# EAGLE schematic qo-100-lnb-controller (EAGLE 9.6.1)
CREVISION: 2; DESIGNER: Joao Silva

## Sheet 1 of 5: MCU
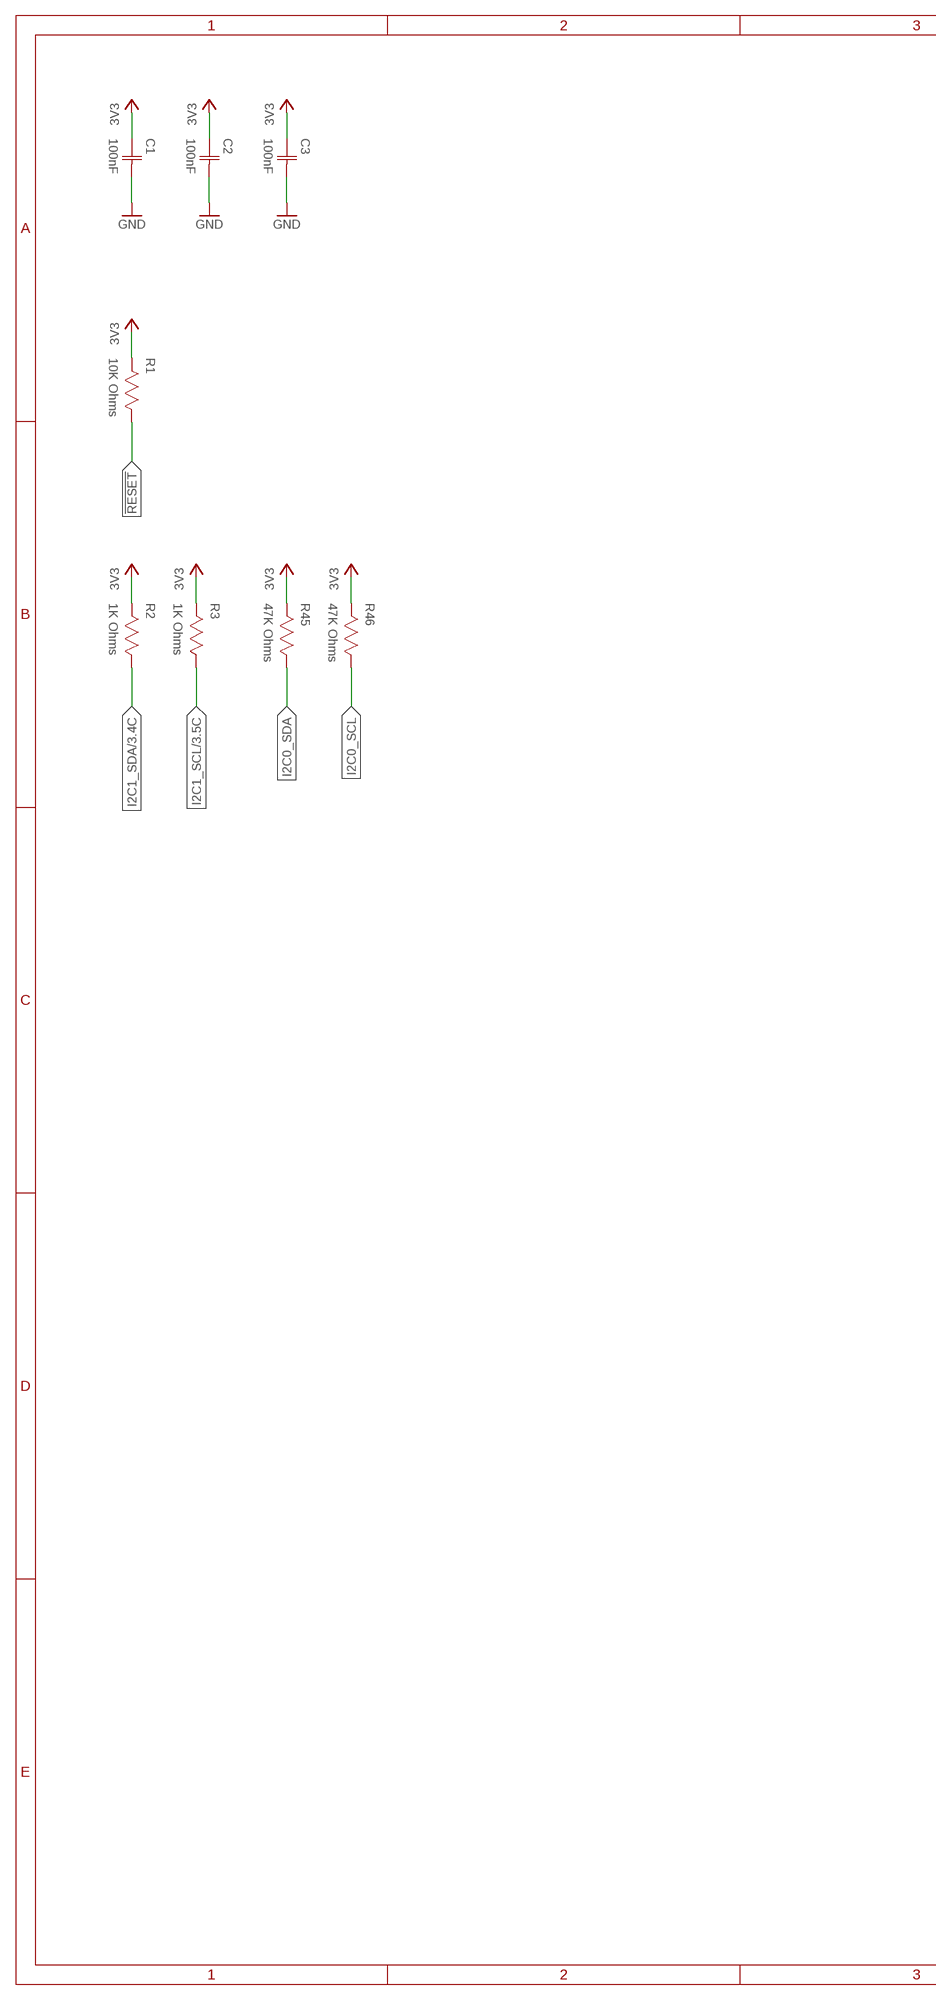
[diagram p0: schematic, sheet 1, part 1 of 2]
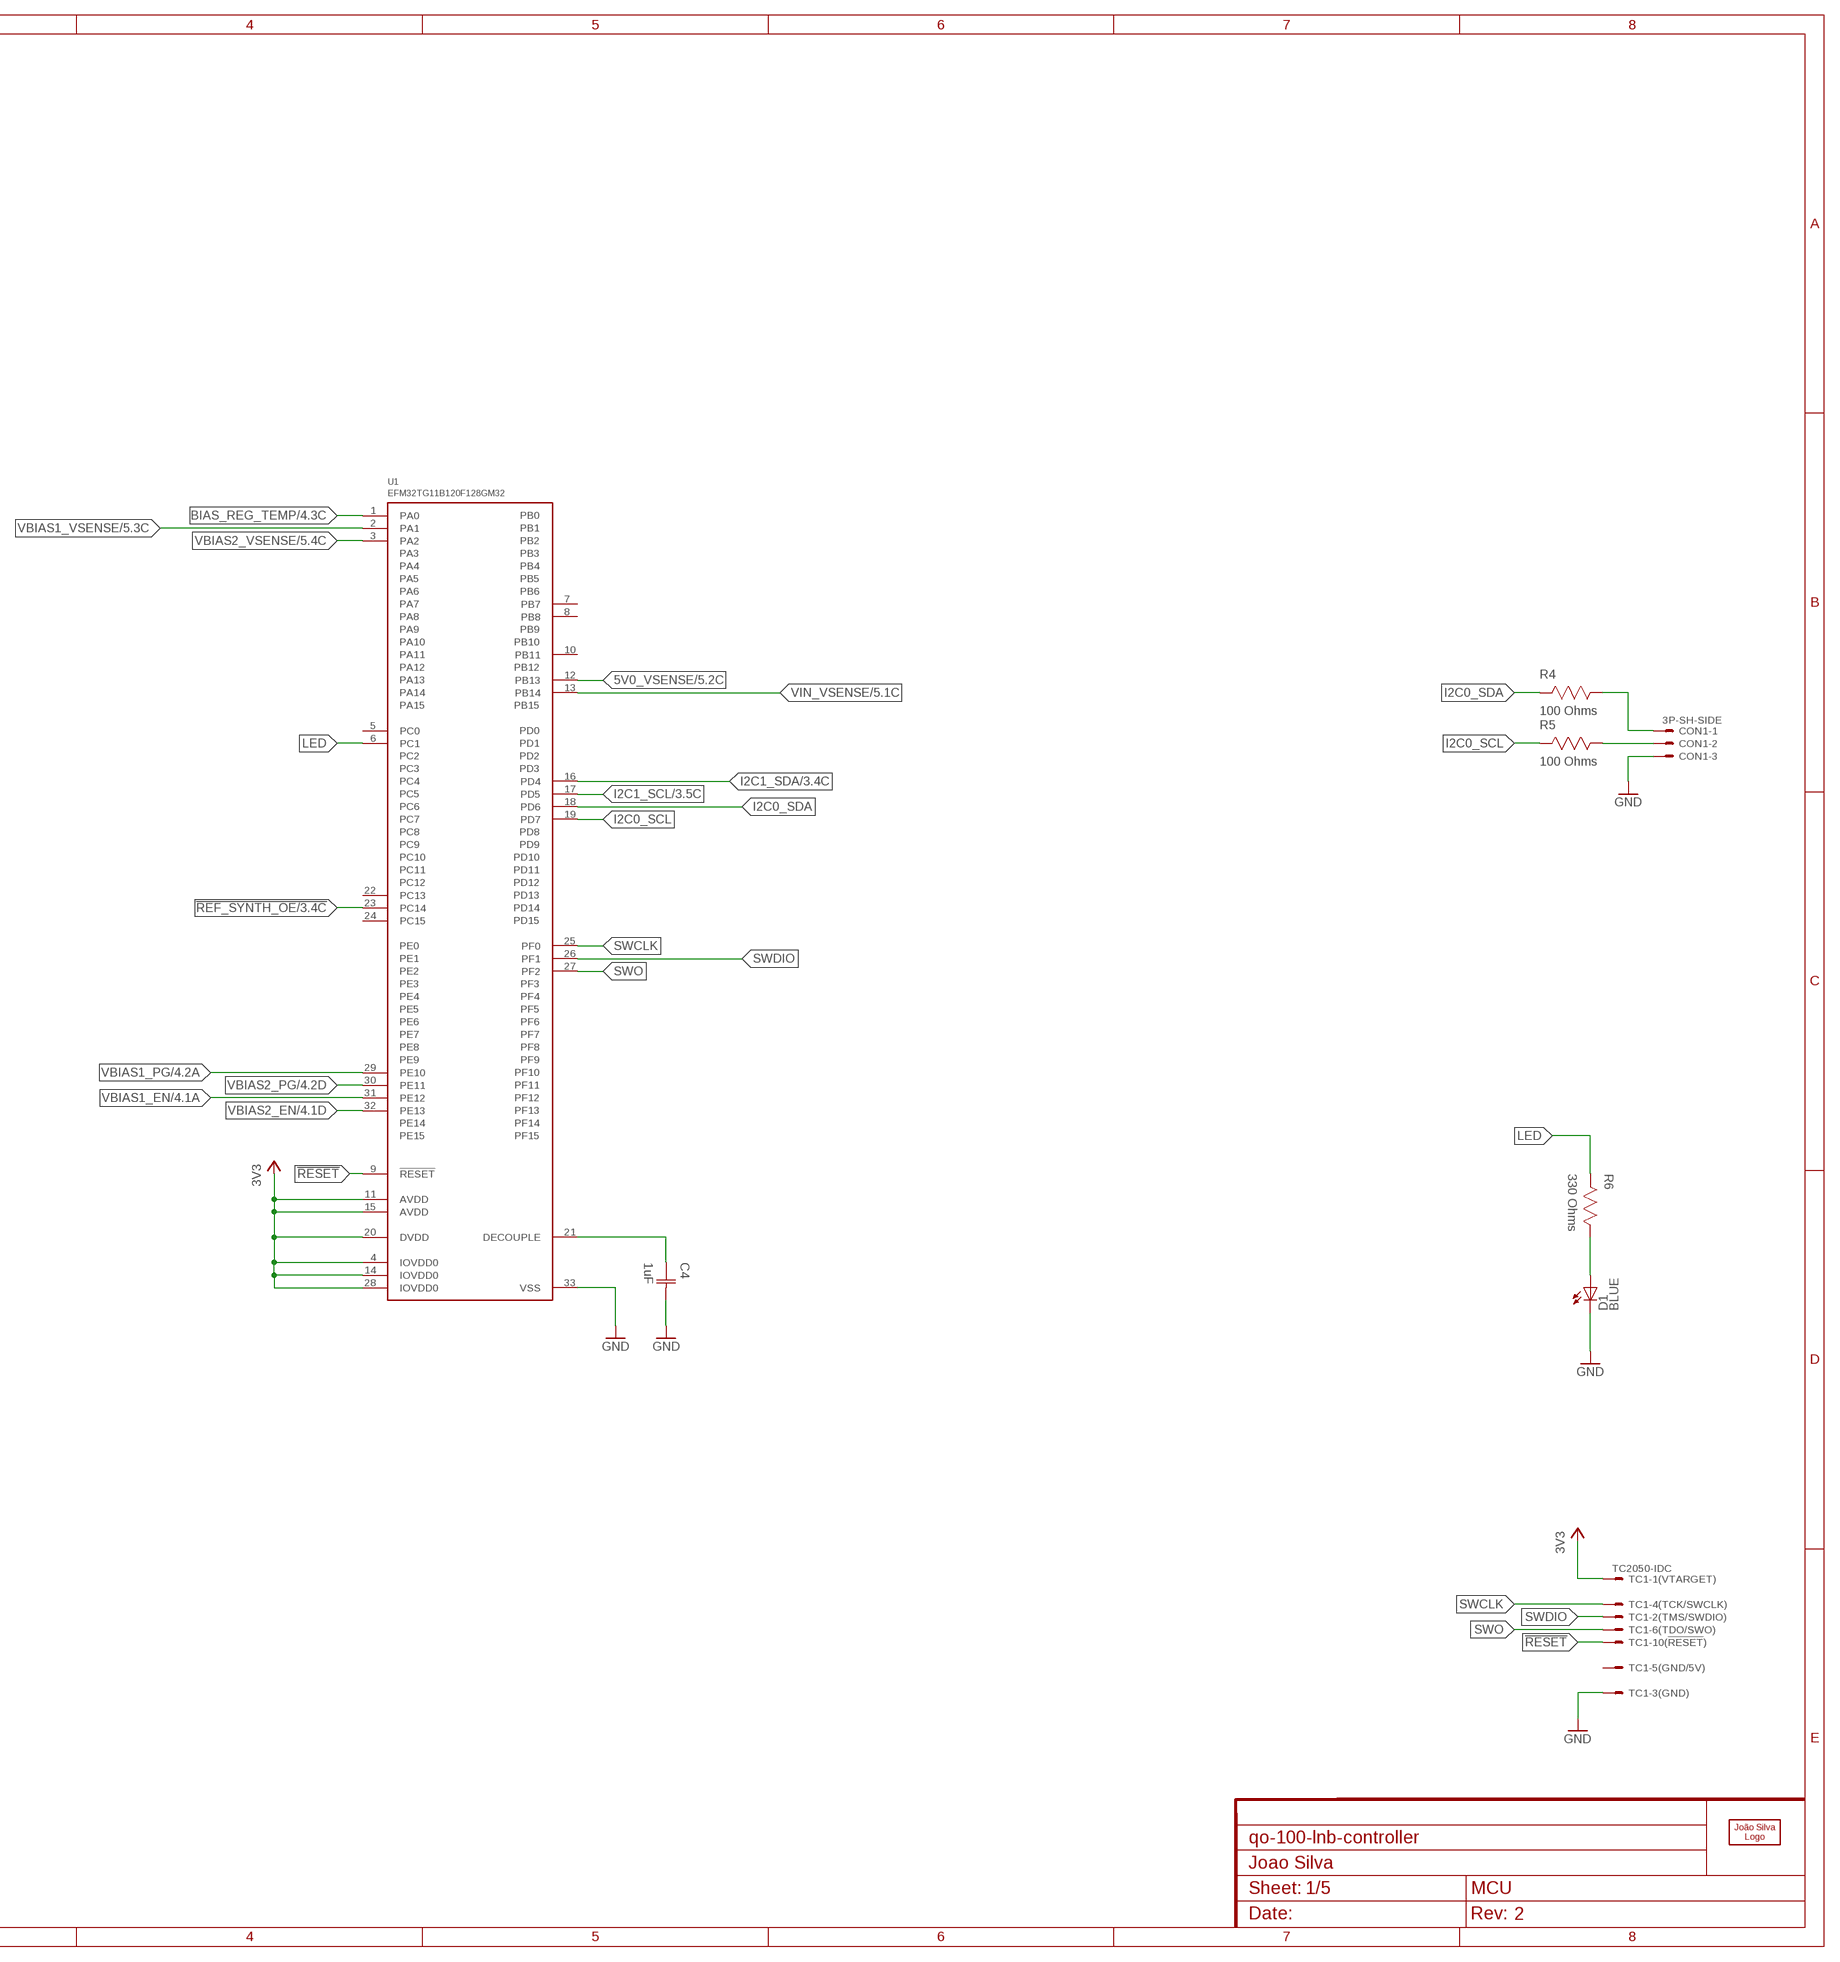
[diagram p1: schematic, sheet 1, part 2 of 2]

### Parts
C1  100nF  CAPACITOR-0603  [CAP0603]
C2  100nF  CAPACITOR-0603  [CAP0603]
C3  100nF  CAPACITOR-0603  [CAP0603]
C4  1uF  CAPACITOR-0603  [CAP0603]
CON1  3P-SH-SIDE  [SH-03-SIDE]
D1  LED0603  [0603]
LOGO1  JS-10MM  [JS_10MM]
R1  10K Ohms  RESISTOR-0603  [RES0603]
R2  1K Ohms  RESISTOR-0603  [RES0603]
R3  1K Ohms  RESISTOR-0603  [RES0603]
R4  100 Ohms  RESISTOR-0603  [RES0603]
R5  100 Ohms  RESISTOR-0603  [RES0603]
R6  330 Ohms  RESISTOR-0603  [RES0603]
R45  47K Ohms  RESISTOR-0603  [RES0603]
R46  47K Ohms  RESISTOR-0603  [RES0603]
TC1  TC2050-IDC  [TC2050-IDC]
U1  EFM32TG11B120F128GM32  [QFN32_0.5P_TG]

### Nets
3V3: C1.1(C1) C2.1(C1) C3.1(C1) R1.2 R2.2 R3.2 R45.2 R46.2 TC1.1 U1.4(IOVDD0) U1.11(AVDD) U1.14(IOVDD0) U1.15(AVDD) U1.20(DVDD) U1.28(IOVDD0) ; also sheet 3,4,5
5V0_VSENSE: U1.12(PB13) ; also sheet 5
!REF_SYNTH_OE: U1.23(PC14) ; also sheet 3
!RESET: R1.1 TC1.10 U1.9(!RESET)
BIAS_REG_TEMP: U1.1(PA0) ; also sheet 4
GND: C1.2(C2) C2.2(C2) C3.2(C2) C4.2(C2) CON1.3 D1.C TC1.3 U1.33(VSS) ; also sheet 2,3,4,5
I2C0_SCL: R5.2 R46.1 U1.19(PD7)
I2C0_SDA: R4.2 R45.1 U1.18(PD6)
I2C1_SCL: R3.1 U1.17(PD5) ; also sheet 3,4
I2C1_SDA: R2.1 U1.16(PD4) ; also sheet 3,4
LED: R6.2 U1.6(PC1)
N$4: CON1.2 R5.1
N$6: C4.1(C1) U1.21(DECOUPLE)
N$25: D1.A R6.1
N$38: CON1.1 R4.1
SWCLK: TC1.4 U1.25(PF0)
SWDIO: TC1.2 U1.26(PF1)
SWO: TC1.6 U1.27(PF2)
VBIAS1_EN: U1.31(PE12) ; also sheet 4
VBIAS1_PG: U1.29(PE10) ; also sheet 4
VBIAS1_VSENSE: U1.2(PA1) ; also sheet 5
VBIAS2_EN: U1.32(PE13) ; also sheet 4
VBIAS2_PG: U1.30(PE11) ; also sheet 4
VBIAS2_VSENSE: U1.3(PA2) ; also sheet 5
VIN_VSENSE: U1.13(PB14) ; also sheet 5
Unconnected: TC1.5 TC1.7 TC1.8 TC1.9 U1.5(PC0) U1.7(PB7) U1.8(PB8) U1.10(PB11) U1.22(PC13) U1.24(PC15)

## Sheet 2 of 5: RF Path
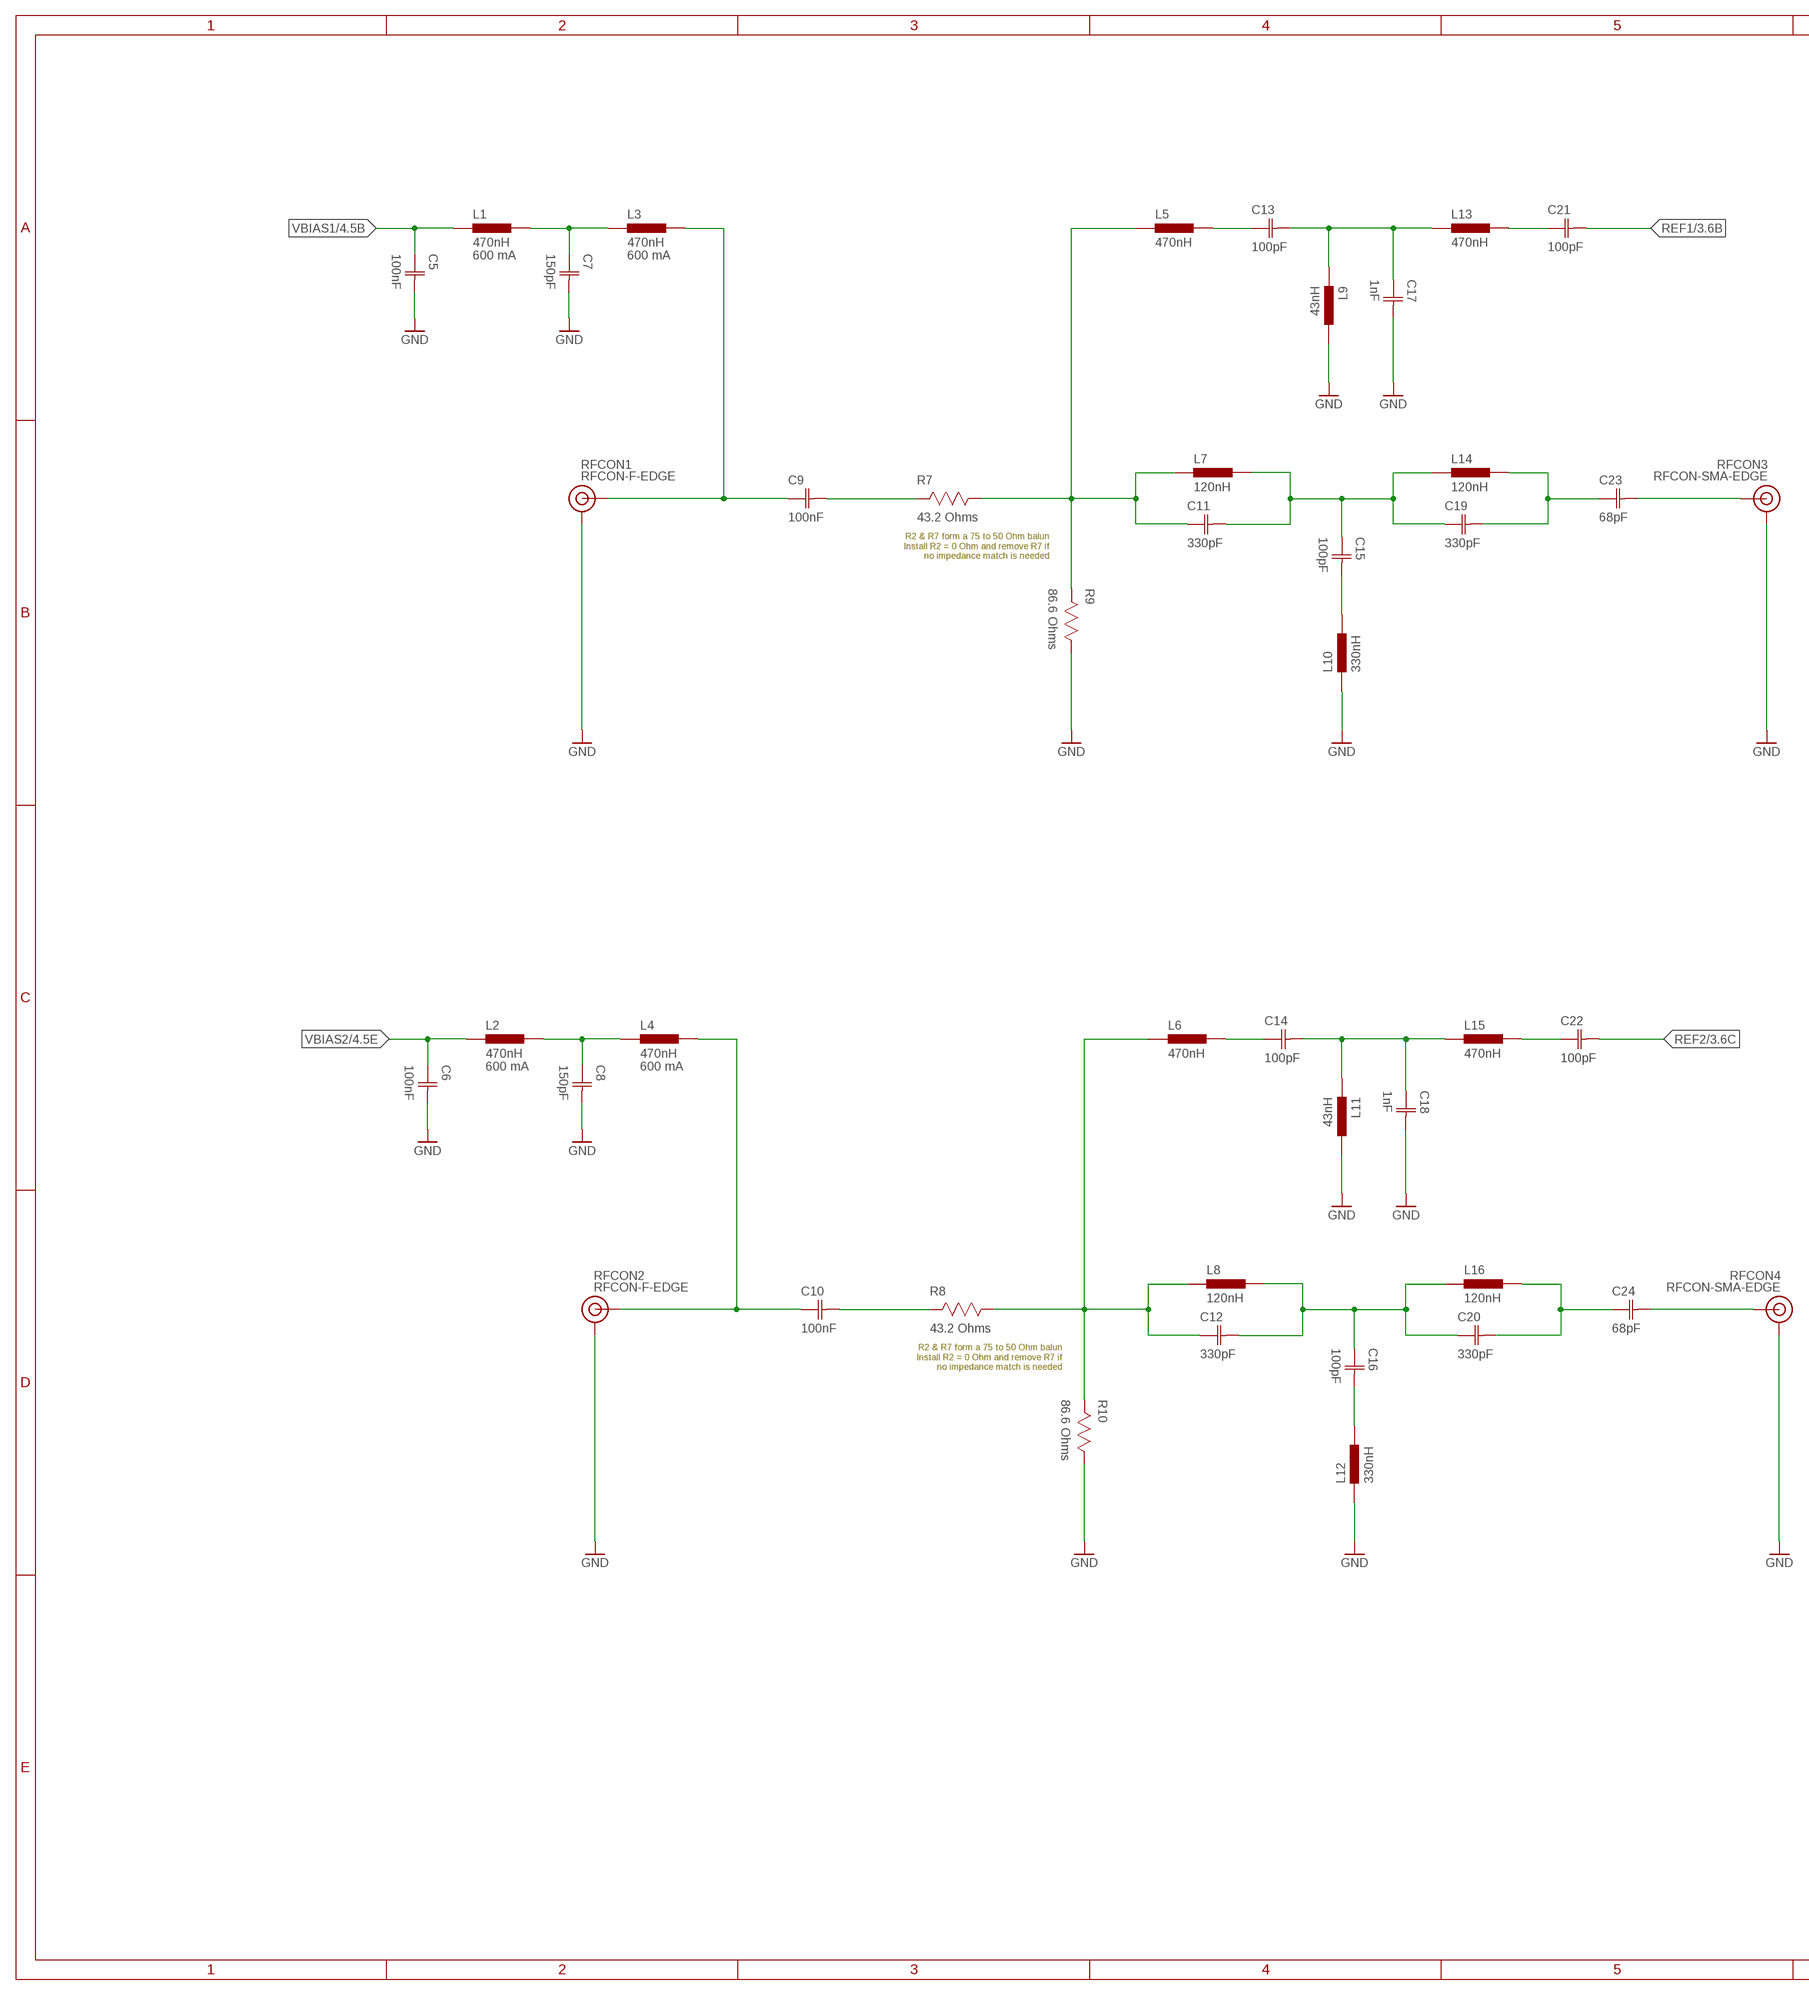
[diagram p2: schematic, sheet 2, part 1 of 2]
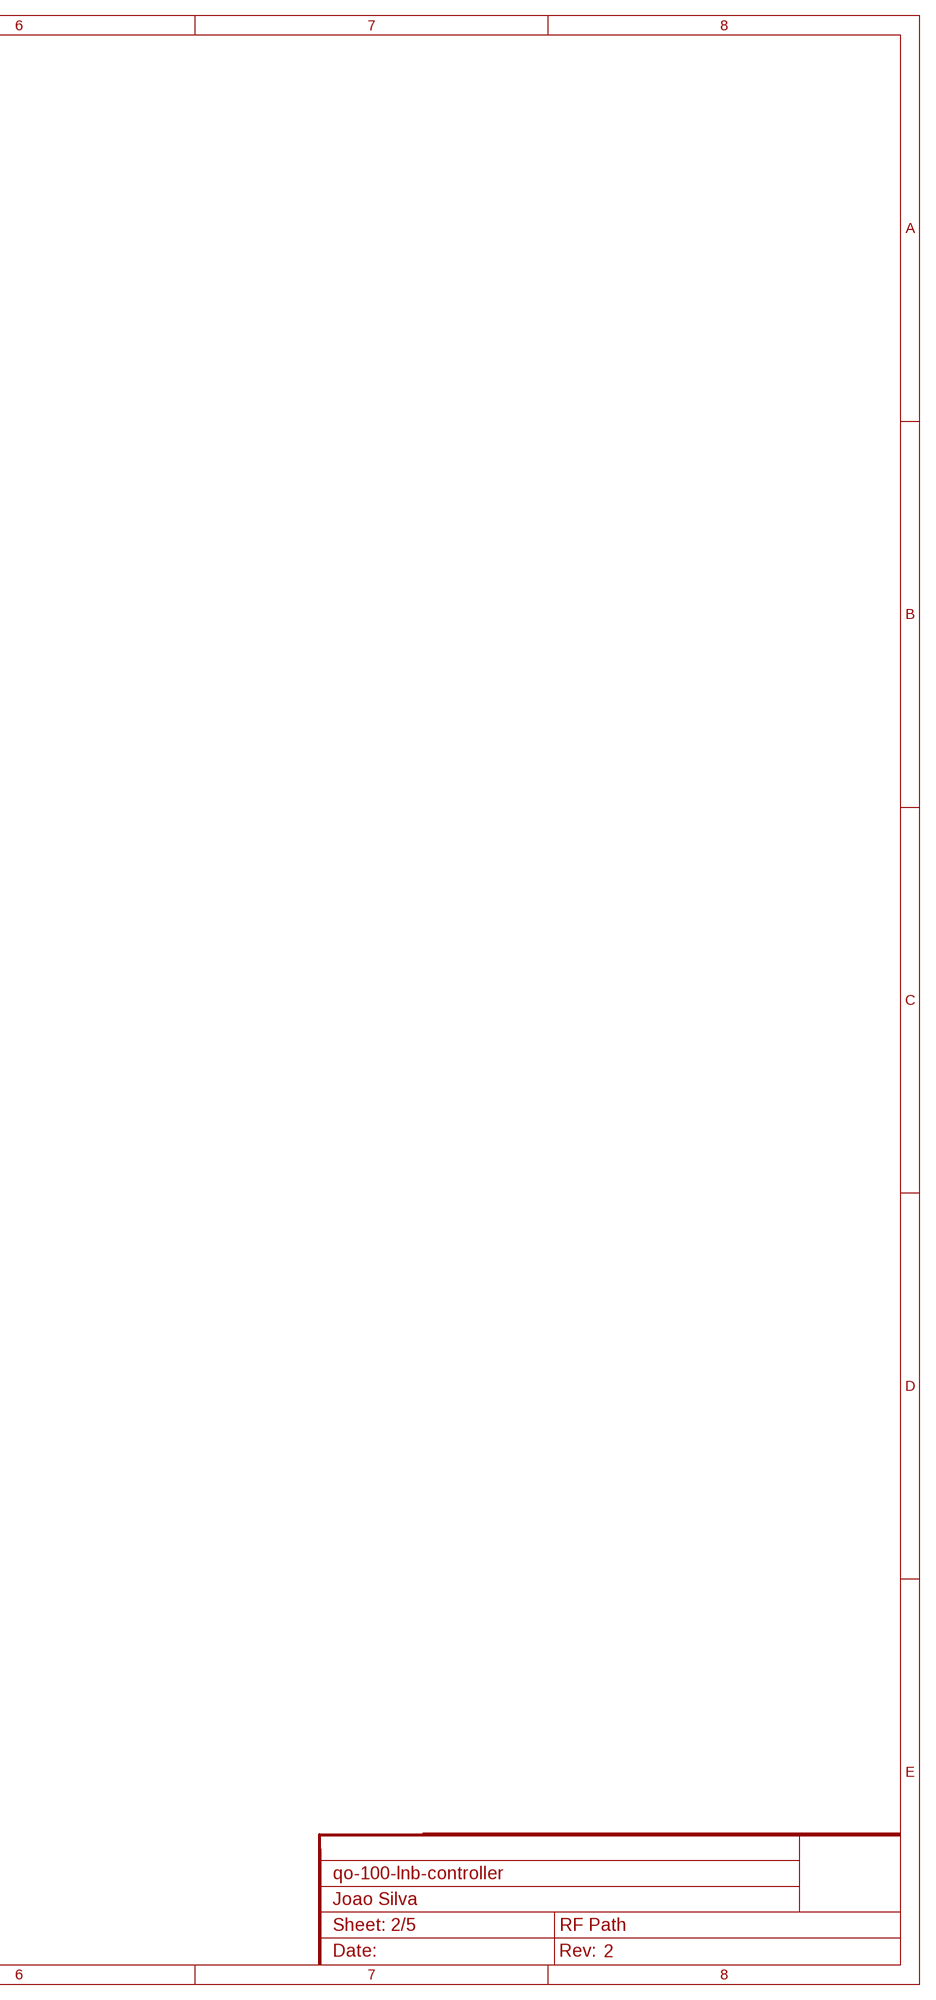
[diagram p3: schematic, sheet 2, part 2 of 2]

### Parts
C5  100nF  CAPACITOR-0603  [CAP0603]
C6  100nF  CAPACITOR-0603  [CAP0603]
C7  150pF  CAPACITOR-0603  [CAP0603]
C8  150pF  CAPACITOR-0603  [CAP0603]
C9  100nF  CAPACITOR-0603  [CAP0603]
C10  100nF  CAPACITOR-0603  [CAP0603]
C11  330pF  CAPACITOR-0603  [CAP0603]
C12  330pF  CAPACITOR-0603  [CAP0603]
C13  100pF  CAPACITOR-0603  [CAP0603]
C14  100pF  CAPACITOR-0603  [CAP0603]
C15  100pF  CAPACITOR-0603  [CAP0603]
C16  100pF  CAPACITOR-0603  [CAP0603]
C17  1nF  CAPACITOR-0603  [CAP0603]
C18  1nF  CAPACITOR-0603  [CAP0603]
C19  330pF  CAPACITOR-0603  [CAP0603]
C20  330pF  CAPACITOR-0603  [CAP0603]
C21  100pF  CAPACITOR-0603  [CAP0603]
C22  100pF  CAPACITOR-0603  [CAP0603]
C23  68pF  CAPACITOR-0603  [CAP0603]
C24  68pF  CAPACITOR-0603  [CAP0603]
L1  470nH  INDUCTOR-0603  [IND0603]
L2  470nH  INDUCTOR-0603  [IND0603]
L3  470nH  INDUCTOR-0603  [IND0603]
L4  470nH  INDUCTOR-0603  [IND0603]
L5  470nH  INDUCTOR-0603  [IND0603]
L6  470nH  INDUCTOR-0603  [IND0603]
L7  120nH  INDUCTOR-0603  [IND0603]
L8  120nH  INDUCTOR-0603  [IND0603]
L9  43nH  INDUCTOR-0603  [IND0603]
L10  330nH  INDUCTOR-0603  [IND0603]
L11  43nH  INDUCTOR-0603  [IND0603]
L12  330nH  INDUCTOR-0603  [IND0603]
L13  470nH  INDUCTOR-0603  [IND0603]
L14  120nH  INDUCTOR-0603  [IND0603]
L15  470nH  INDUCTOR-0603  [IND0603]
L16  120nH  INDUCTOR-0603  [IND0603]
R7  43.2 Ohms  RESISTOR-0603  [RES0603]
R8  43.2 Ohms  RESISTOR-0603  [RES0603]
R9  86.6 Ohms  RESISTOR-0603  [RES0603]
R10  86.6 Ohms  RESISTOR-0603  [RES0603]
RFCON1  RFCON-F-EDGE  [F-EDGE]
RFCON2  RFCON-F-EDGE  [F-EDGE]
RFCON3  RFCON-SMA-EDGE  [SMA-EDGE]
RFCON4  RFCON-SMA-EDGE  [SMA-EDGE]

### Nets
GND: C5.2(C2) C6.2(C2) C7.2(C2) C8.2(C2) C17.2(C2) C18.2(C2) L9.2 L10.1 L11.2 L12.1 R9.1 R10.1 RFCON1.GND@0(GND) RFCON1.GND@1(GND) RFCON1.GND@2(GND) RFCON1.GND@3(GND) RFCON1.GND@4(GND) RFCON1.GND@5(GND) RFCON2.GND@0(GND) RFCON2.GND@1(GND) RFCON2.GND@2(GND) RFCON2.GND@3(GND) RFCON2.GND@4(GND) RFCON2.GND@5(GND) RFCON3.GND@0(GND) RFCON3.GND@1(GND) RFCON3.GND@2(GND) RFCON3.GND@3(GND) RFCON4.GND@0(GND) RFCON4.GND@1(GND) RFCON4.GND@2(GND) RFCON4.GND@3(GND) ; also sheet 1,3,4,5
N$9 [75 Ohm]: C9.1(C1) L3.2 RFCON1.SIGNAL
N$10 [75 Ohm]: C9.2(C2) R7.2
N$12: C21.1(C1) L13.2
N$13: C7.1(C1) L1.2 L3.1
N$14: C13.1(C1) L5.2
N$15: C13.2(C2) C17.1(C1) L9.1 L13.1
N$16: C19.2(C2) C23.1(C1) L14.2
N$17: C11.1(C1) L5.1 L7.1 R7.1 R9.2
N$18: C11.2(C2) C15.1(C1) C19.1(C1) L7.2 L14.1
N$20: C23.2(C2) RFCON3.SIG(SIGNAL)
N$22: C15.2(C2) L10.2
N$24 [75 Ohm]: C10.1(C1) L4.2 RFCON2.SIGNAL
N$26 [75 Ohm]: C10.2(C2) R8.2
N$27: C8.1(C1) L2.2 L4.1
N$28: C22.1(C1) L15.2
N$29: C14.1(C1) L6.2
N$30: C14.2(C2) C18.1(C1) L11.1 L15.1
N$31: C12.1(C1) L6.1 L8.1 R8.1 R10.2
N$32: C12.2(C2) C16.1(C1) C20.1(C1) L8.2 L16.1
N$33: C24.2(C2) RFCON4.SIG(SIGNAL)
N$34: C16.2(C2) L12.2
N$35: C20.2(C2) C24.1(C1) L16.2
REF1: C21.2(C2) ; also sheet 3
REF2: C22.2(C2) ; also sheet 3
VBIAS1: C5.1(C1) L1.1 ; also sheet 4,5
VBIAS2: C6.1(C1) L2.1 ; also sheet 4,5

### Notes on the sheet
- R2 & R7 form a 75 to 50 Ohm balun
  Install R2 = 0 Ohm and remove R7 if
  no impedance match is needed
- R2 & R7 form a 75 to 50 Ohm balun
  Install R2 = 0 Ohm and remove R7 if
  no impedance match is needed

## Sheet 3 of 5: Reference Synthesizer
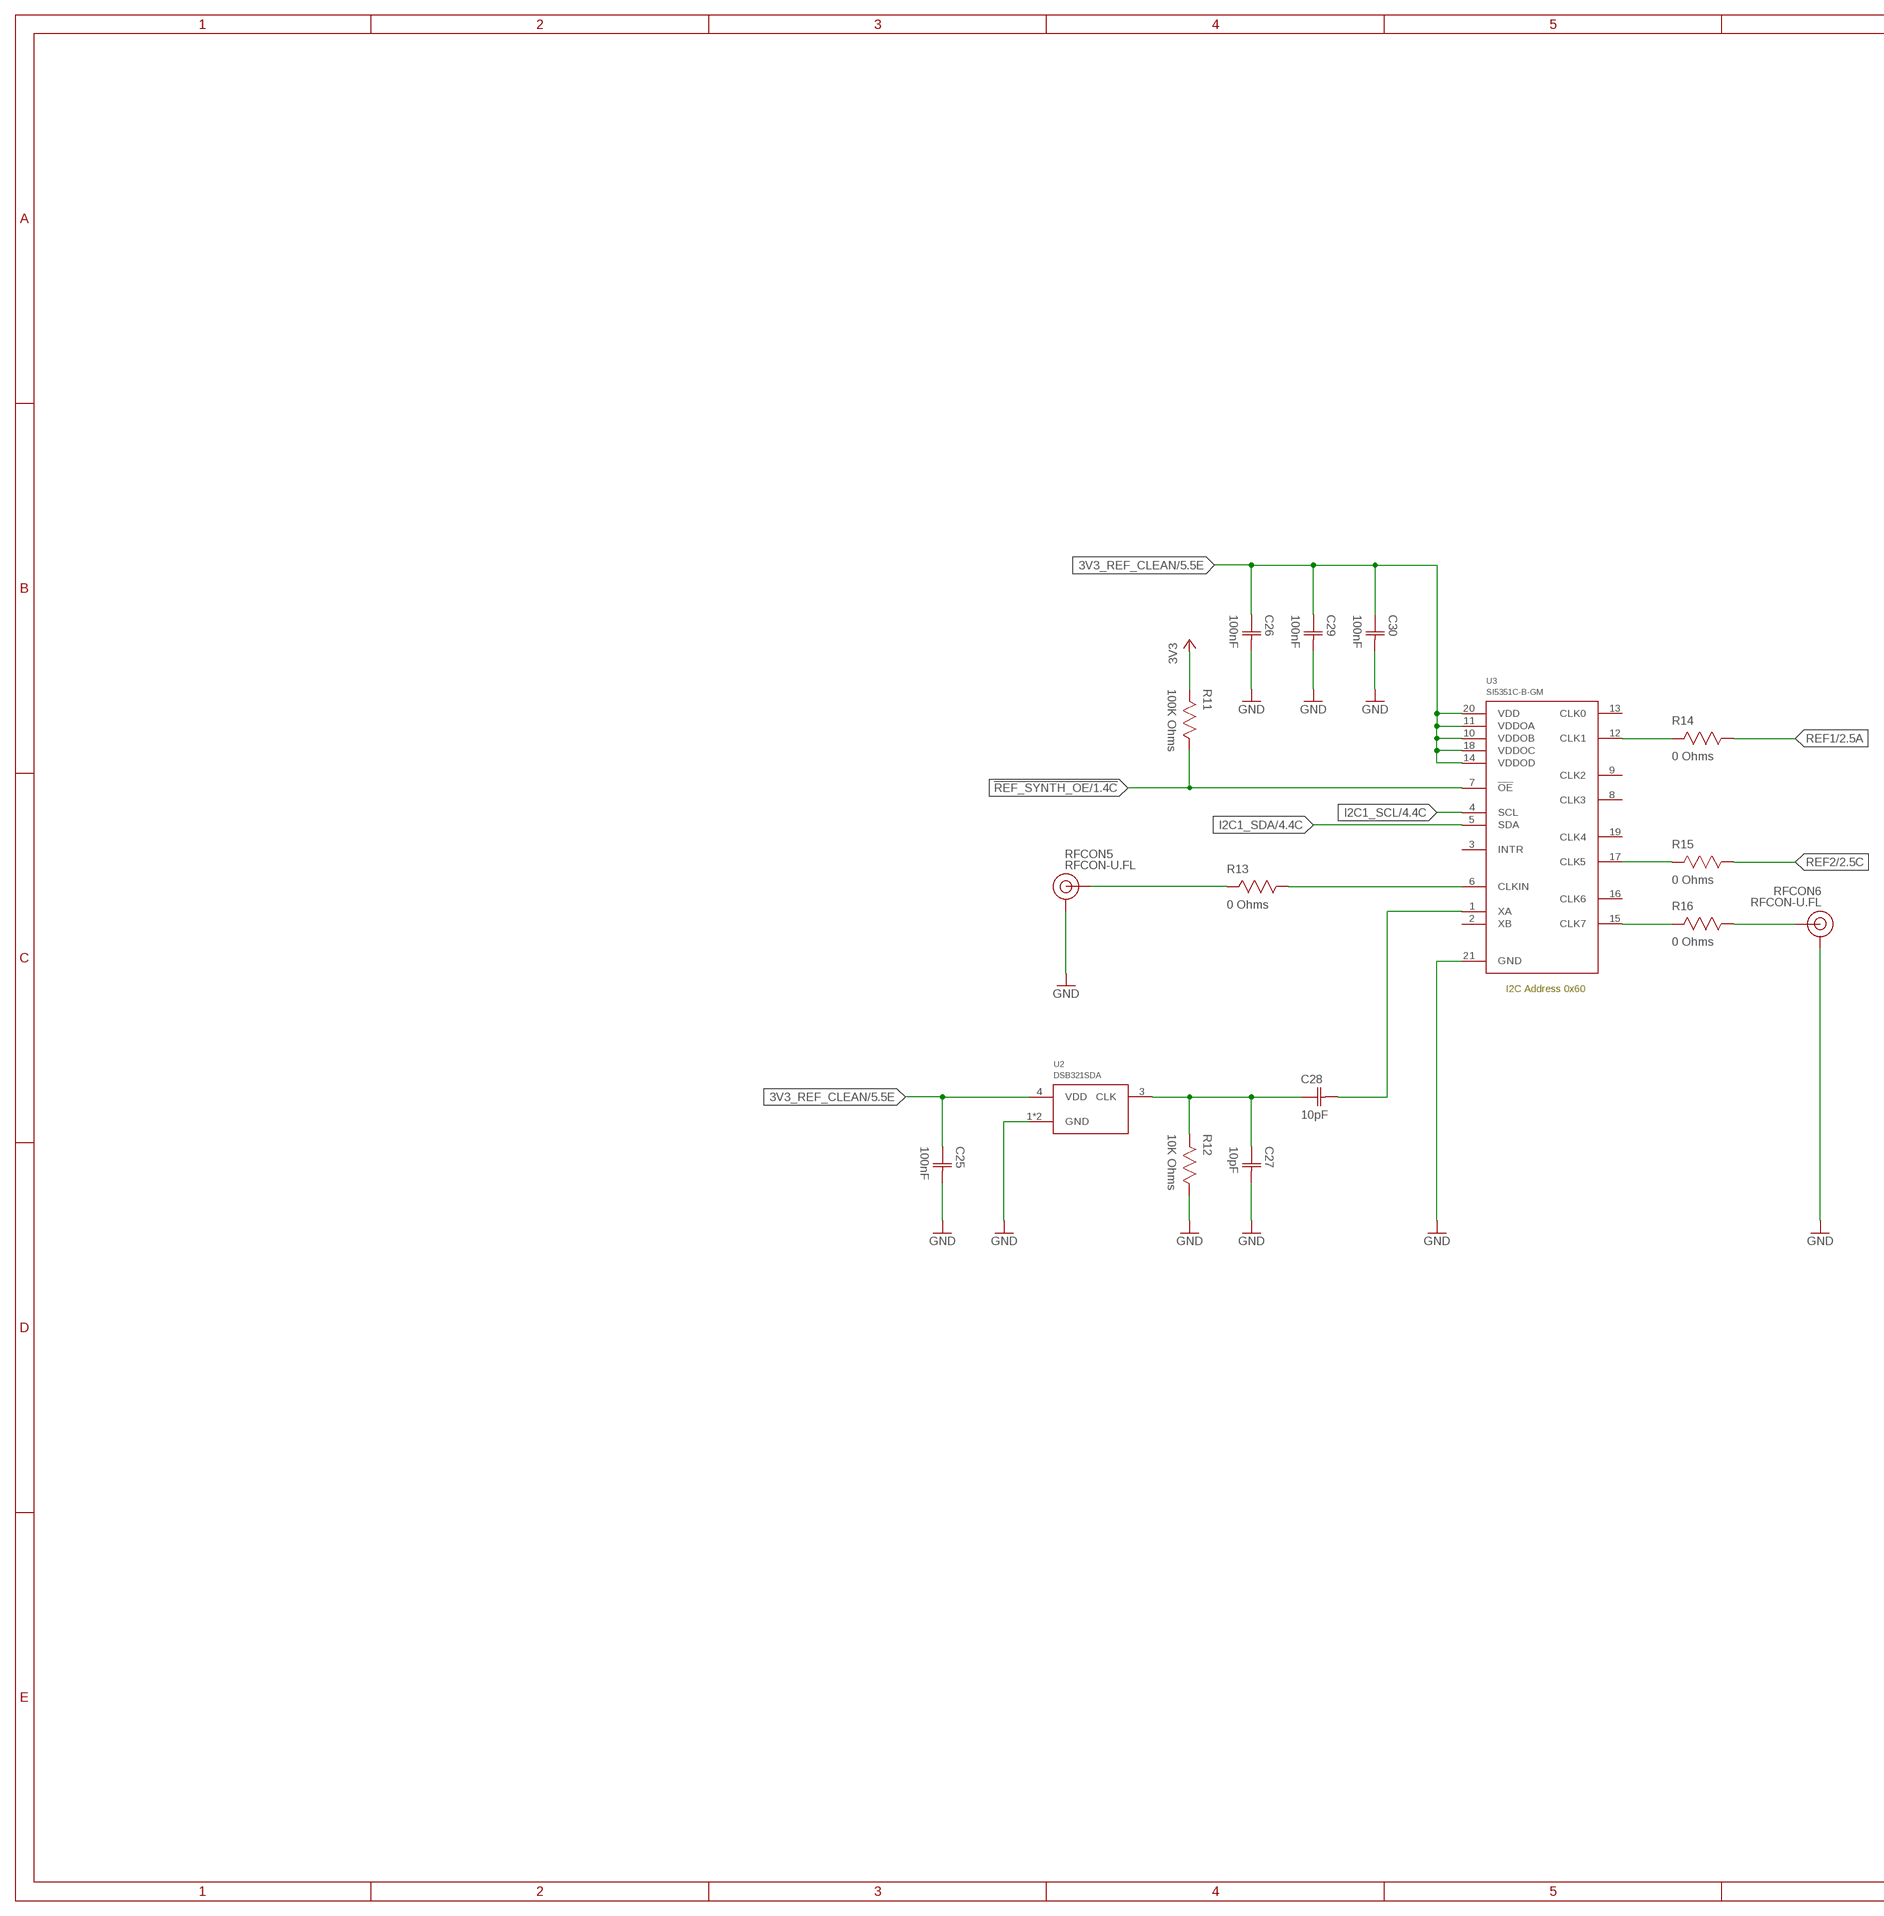
[diagram p4: schematic, sheet 3, part 1 of 2]
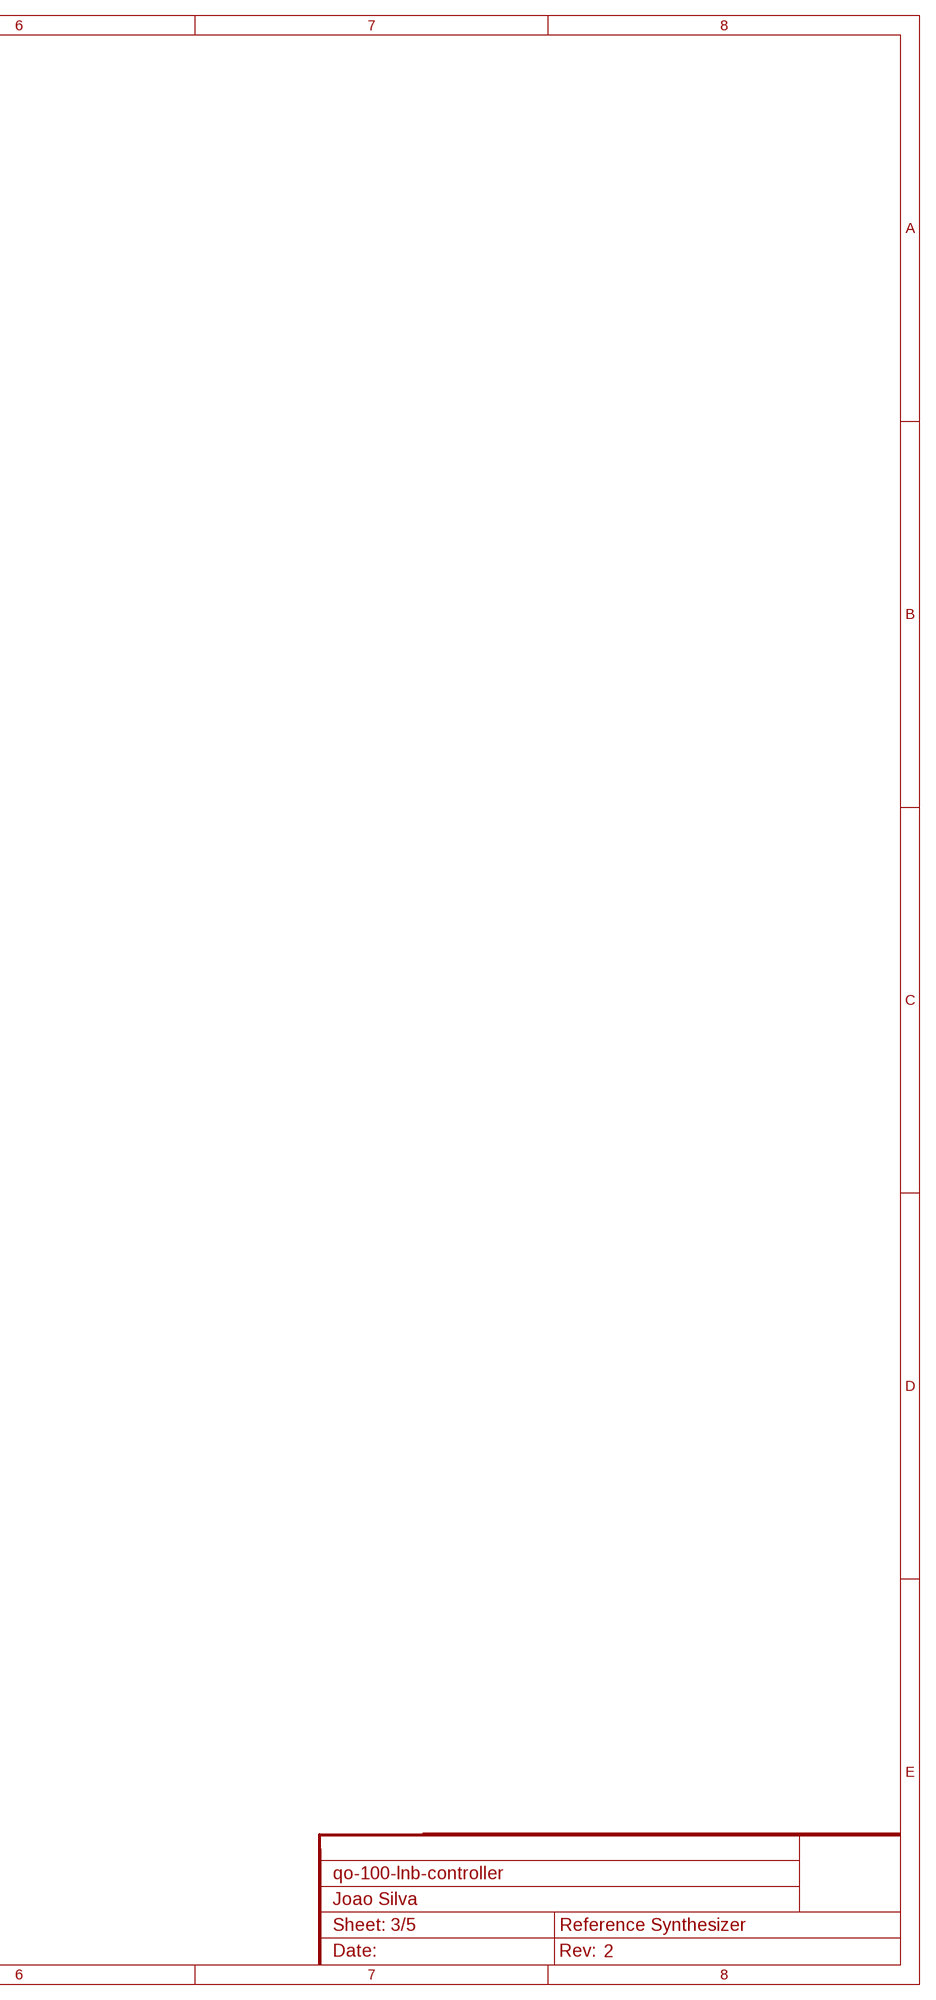
[diagram p5: schematic, sheet 3, part 2 of 2]

### Parts
C25  100nF  CAPACITOR-0603  [CAP0603]
C26  100nF  CAPACITOR-0603  [CAP0603]
C27  10pF  CAPACITOR-0603  [CAP0603]
C28  10pF  CAPACITOR-0603  [CAP0603]
C29  100nF  CAPACITOR-0603  [CAP0603]
C30  100nF  CAPACITOR-0603  [CAP0603]
R11  100K Ohms  RESISTOR-0603  [RES0603]
R12  10K Ohms  RESISTOR-0603  [RES0603]
R13  0 Ohms  RESISTOR-0603  [RES0603]
R14  0 Ohms  RESISTOR-0603  [RES0603]
R15  0 Ohms  RESISTOR-0603  [RES0603]
R16  0 Ohms  RESISTOR-0603  [RES0603]
RFCON5  RFCON-U.FL  [U.FL]
RFCON6  RFCON-U.FL  [U.FL]
U2  DSB321SDA  [TCXO-3225]
U3  SI5351C-B-GM  [QFN20]

### Nets
3V3: R11.2 ; also sheet 1,4,5
3V3_REF_CLEAN: C25.1(C1) C26.1(C1) C29.1(C1) C30.1(C1) U2.4(VDD) U3.10(VDDOB) U3.11(VDDOA) U3.14(VDDOD) U3.18(VDDOC) U3.20(VDD) ; also sheet 5
!REF_SYNTH_OE: R11.1 U3.7(!OE) ; also sheet 1
EXT_REF_IN: R13.2 RFCON5.P$3(SIGNAL)
EXT_REF_OUT: R16.1 RFCON6.P$3(SIGNAL)
GND: C25.2(C2) C26.2(C2) C27.2(C2) C29.2(C2) C30.2(C2) R12.1 RFCON5.P$1(GND) RFCON5.P$2(GND) RFCON6.P$1(GND) RFCON6.P$2(GND) U2.1(GND) U2.2(GND) U3.21(GND) ; also sheet 1,2,4,5
I2C1_SCL: U3.4(SCL) ; also sheet 1,4
I2C1_SDA: U3.5(SDA) ; also sheet 1,4
N$1: R16.2 U3.15(CLK7)
N$2: R15.2 U3.17(CLK5)
N$5: R14.2 U3.12(CLK1)
N$7: C27.1(C1) C28.1(C1) R12.2 U2.3(CLK)
N$36: C28.2(C2) U3.1(XA)
N$37: R13.1 U3.6(CLKIN)
REF1: R14.1 ; also sheet 2
REF2: R15.1 ; also sheet 2
Unconnected: U3.2(XB) U3.3(INTR) U3.8(CLK3) U3.9(CLK2) U3.13(CLK0) U3.16(CLK6) U3.19(CLK4)

### Notes on the sheet
- I2C Address 0x60

## Sheet 4 of 5: Power 1 - LNB Bias
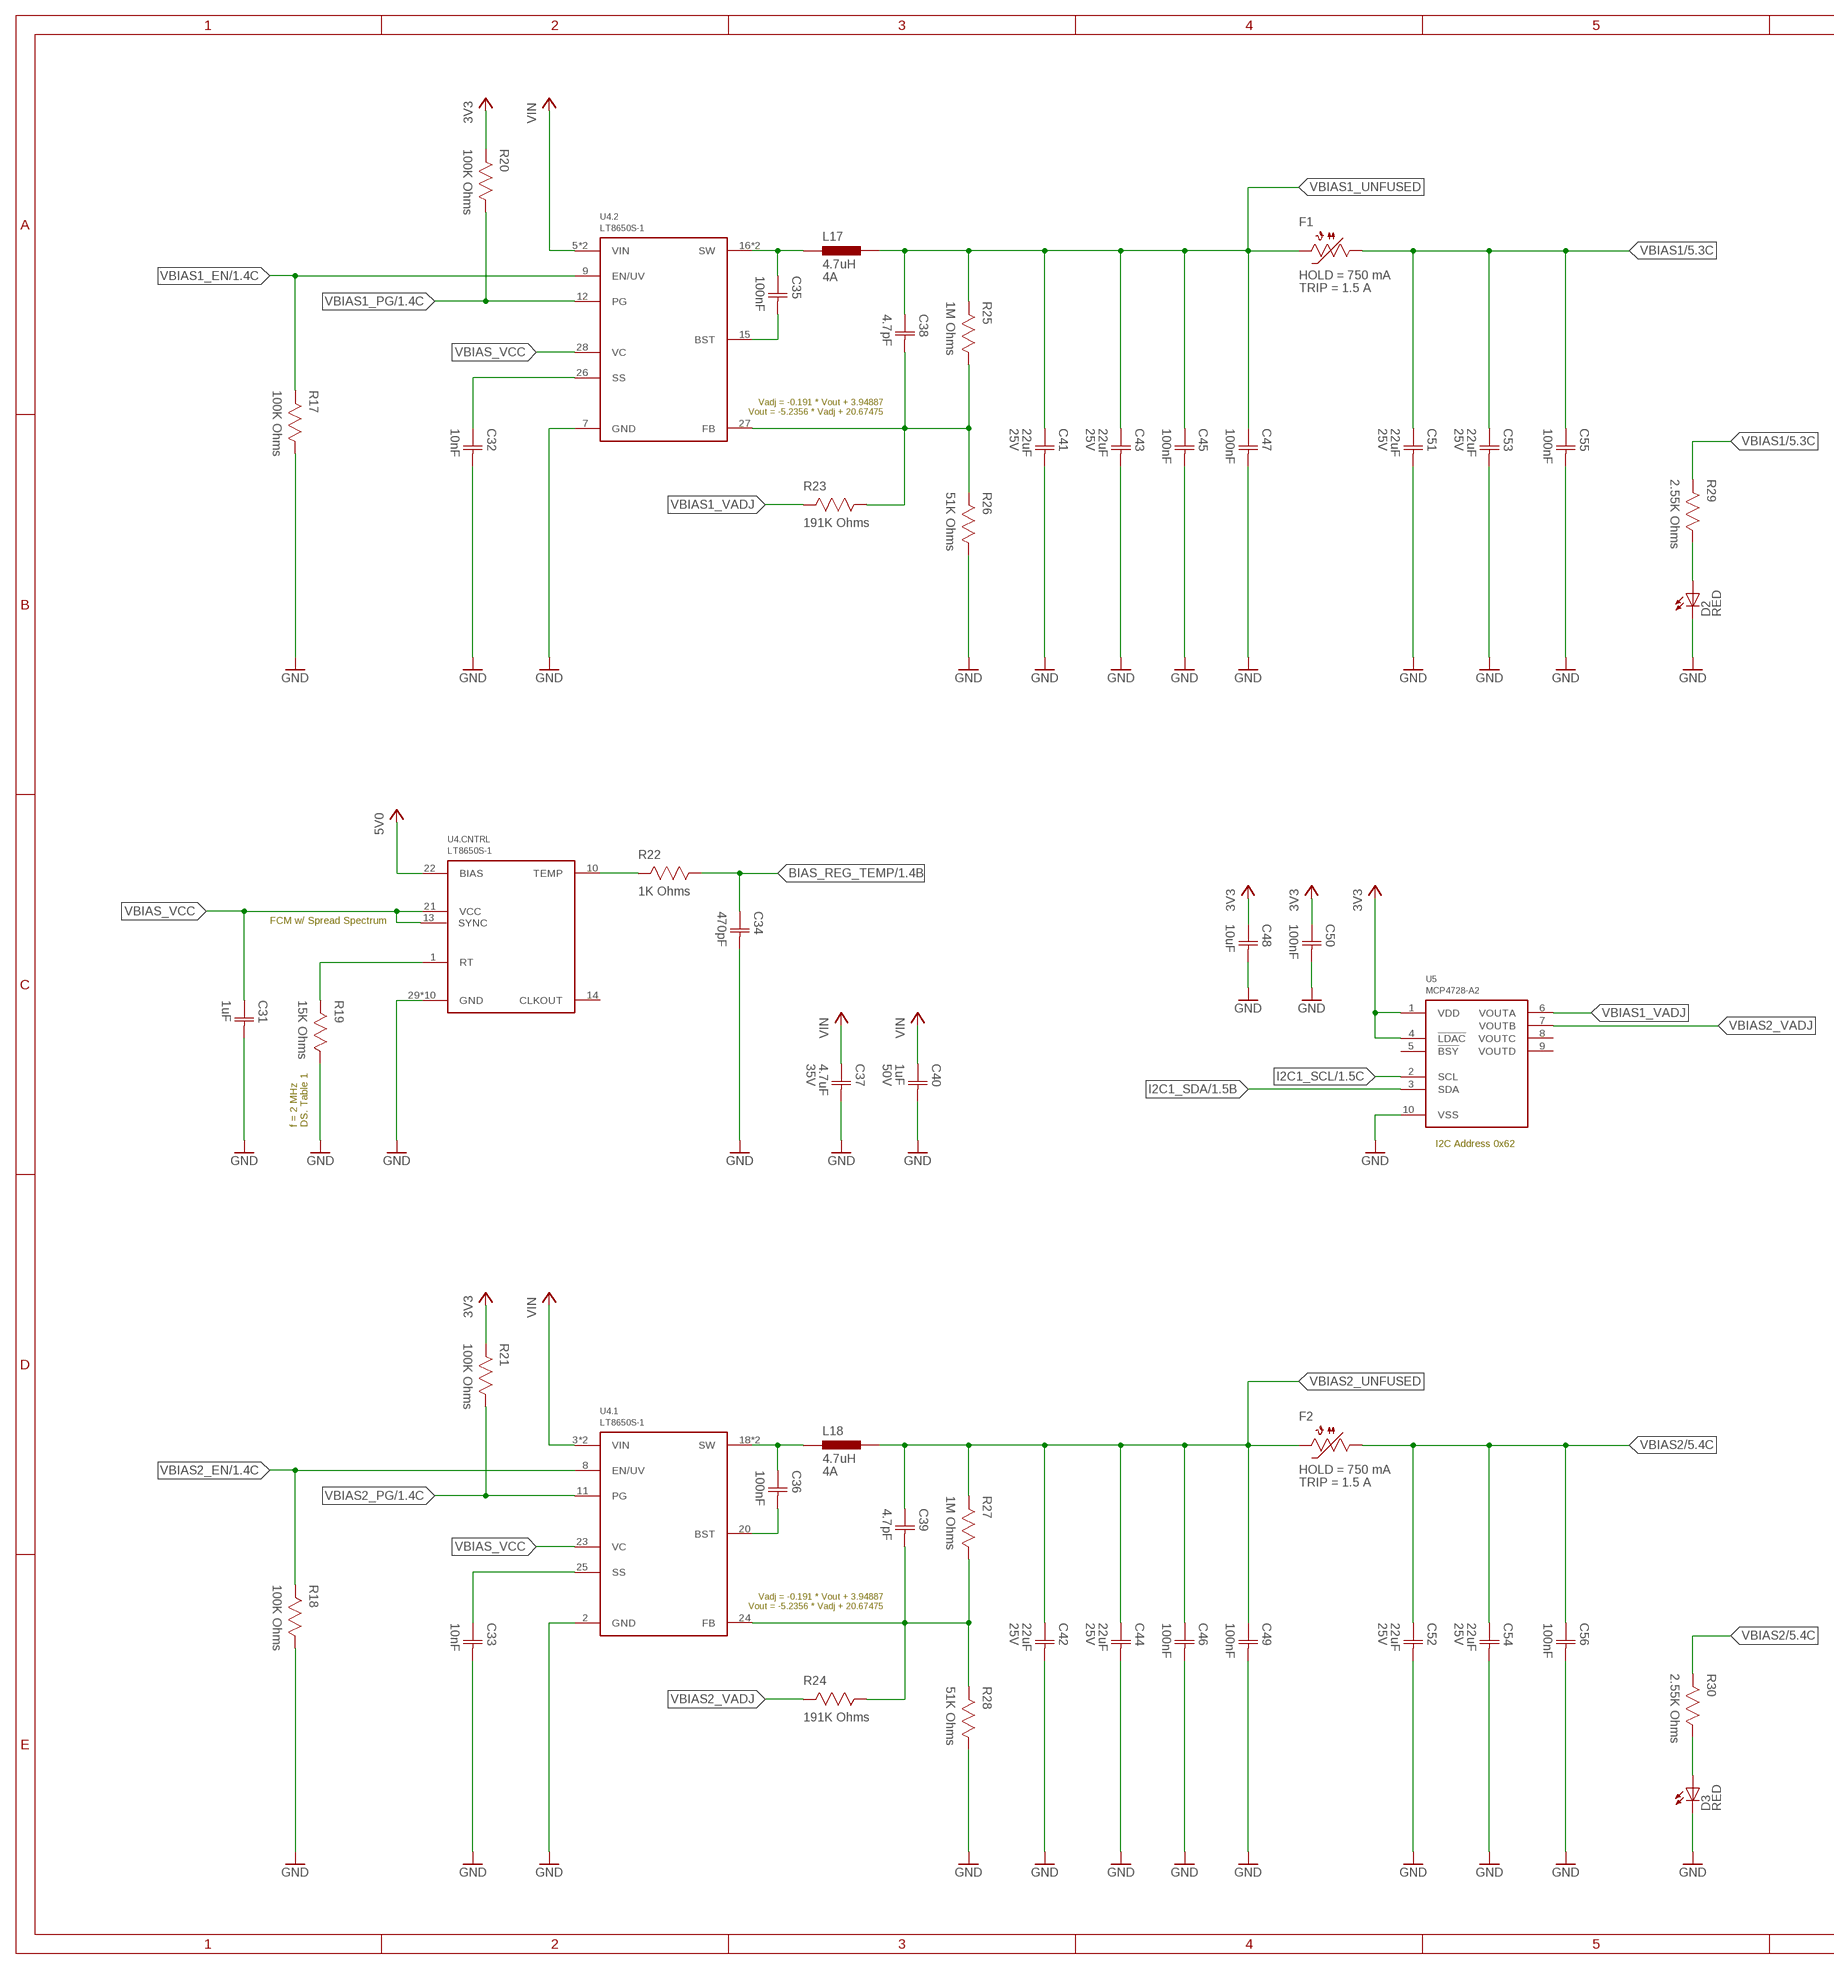
[diagram p6: schematic, sheet 4, part 1 of 2]
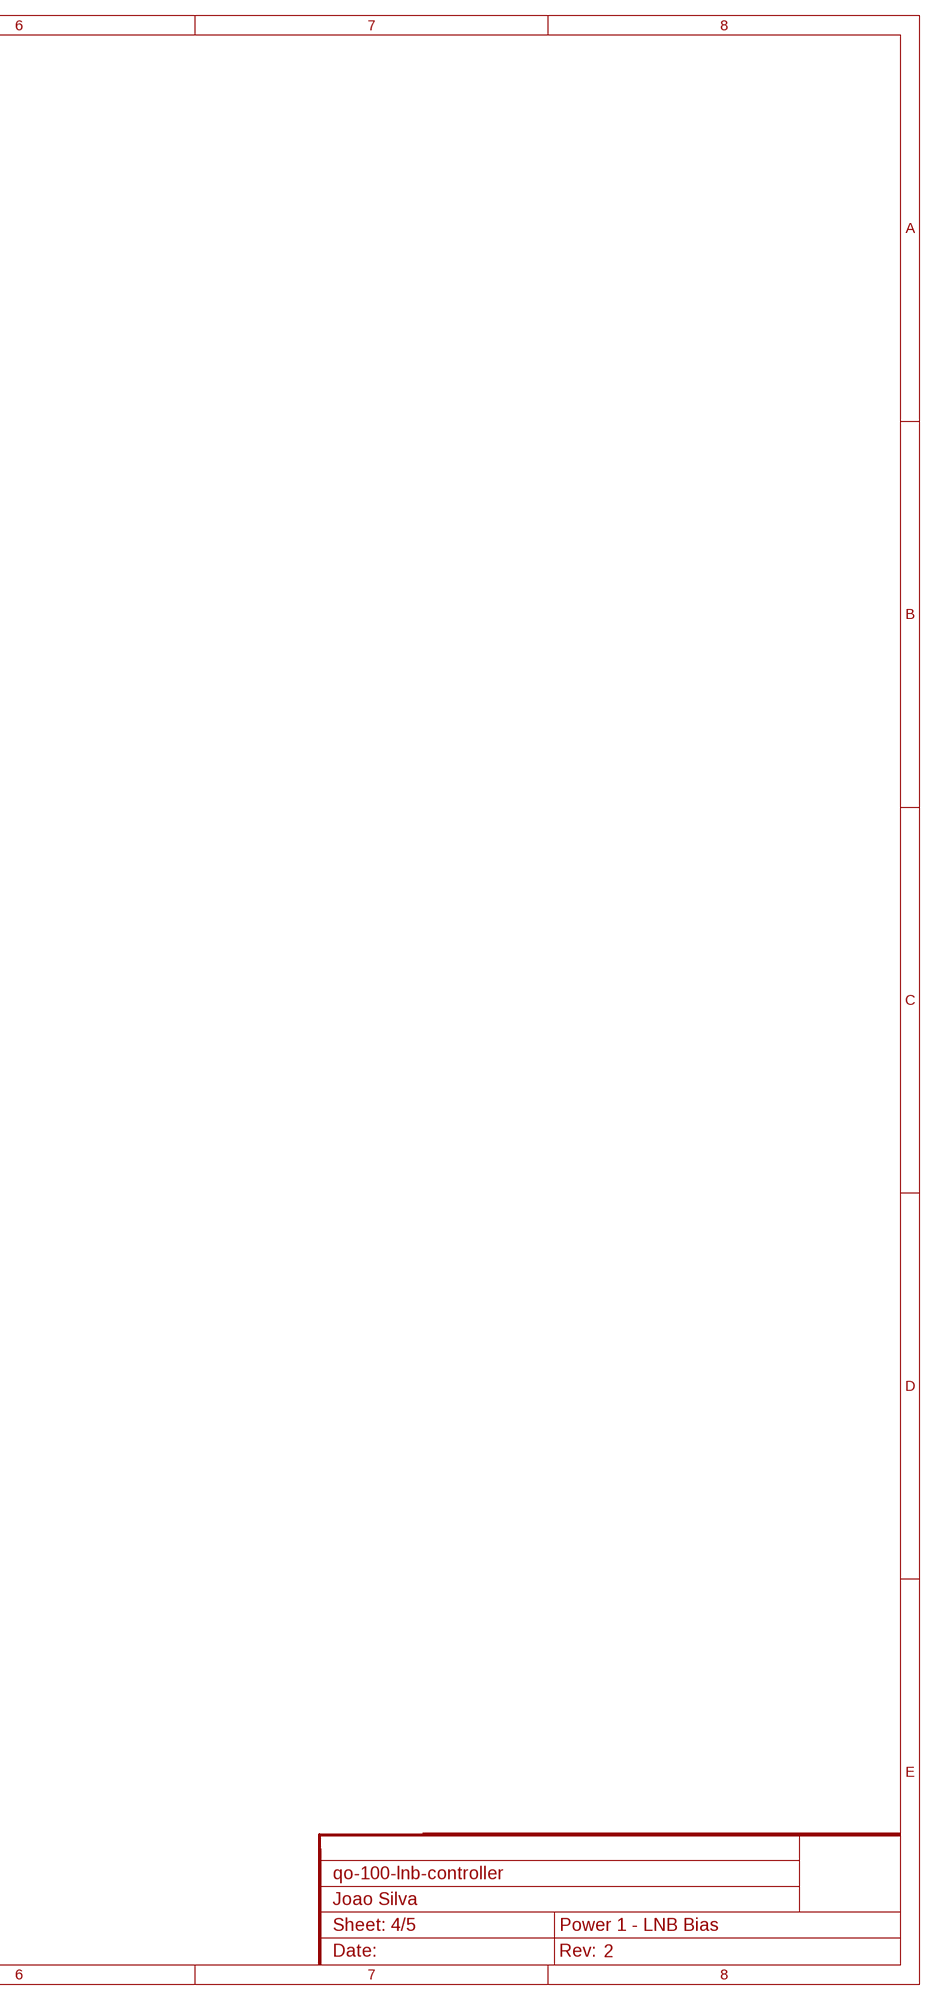
[diagram p7: schematic, sheet 4, part 2 of 2]

### Parts
C31  1uF  CAPACITOR-0603  [CAP0603]
C32  10nF  CAPACITOR-0603  [CAP0603]
C33  10nF  CAPACITOR-0603  [CAP0603]
C34  470pF  CAPACITOR-0603  [CAP0603]
C35  100nF  CAPACITOR-0603  [CAP0603]
C36  100nF  CAPACITOR-0603  [CAP0603]
C37  4.7uF  CAPACITOR-0603  [CAP0603]
C38  4.7pF  CAPACITOR-0603  [CAP0603]
C39  4.7pF  CAPACITOR-0603  [CAP0603]
C40  1uF  CAPACITOR-0603  [CAP0603]
C41  22uF  CAPACITOR-1206  [CAP1206]
C42  22uF  CAPACITOR-1206  [CAP1206]
C43  22uF  CAPACITOR-1206  [CAP1206]
C44  22uF  CAPACITOR-1206  [CAP1206]
C45  100nF  CAPACITOR-0603  [CAP0603]
C46  100nF  CAPACITOR-0603  [CAP0603]
C47  100nF  CAPACITOR-0603  [CAP0603]
C48  10uF  CAPACITOR-0603  [CAP0603]
C49  100nF  CAPACITOR-0603  [CAP0603]
C50  100nF  CAPACITOR-0603  [CAP0603]
C51  22uF  CAPACITOR-1206  [CAP1206]
C52  22uF  CAPACITOR-1206  [CAP1206]
C53  22uF  CAPACITOR-1206  [CAP1206]
C54  22uF  CAPACITOR-1206  [CAP1206]
C55  100nF  CAPACITOR-0603  [CAP0603]
C56  100nF  CAPACITOR-0603  [CAP0603]
D2  LED0603  [0603]
D3  LED0603  [0603]
F1  PTC0805  [0805]
F2  PTC0805  [0805]
L17  4.7uH  INDUCTOR-4X4MM  [IND0404]
L18  4.7uH  INDUCTOR-4X4MM  [IND0404]
R17  100K Ohms  RESISTOR-0603  [RES0603]
R18  100K Ohms  RESISTOR-0603  [RES0603]
R19  15K Ohms  RESISTOR-0603  [RES0603]
R20  100K Ohms  RESISTOR-0603  [RES0603]
R21  100K Ohms  RESISTOR-0603  [RES0603]
R22  1K Ohms  RESISTOR-0603  [RES0603]
R23  191K Ohms  RESISTOR-0603  [RES0603]
R24  191K Ohms  RESISTOR-0603  [RES0603]
R25  1M Ohms  RESISTOR-0603  [RES0603]
R26  51K Ohms  RESISTOR-0603  [RES0603]
R27  1M Ohms  RESISTOR-0603  [RES0603]
R28  51K Ohms  RESISTOR-0603  [RES0603]
R29  2.55K Ohms  RESISTOR-0603  [RES0603]
R30  2.55K Ohms  RESISTOR-0603  [RES0603]
U4  LT8650S-1  [QFN28_ASYM_CORNER]
U5  MCP4728-A2  [MSOP10]

### Nets
3V3: C48.1(C1) C50.1(C1) R20.2 R21.2 U5.1(VDD) U5.4(!LDAC) ; also sheet 1,3,5
5V0: U4.22(.CNTRL:BIAS) ; also sheet 5
BIAS_REG_TEMP: C34.1(C1) R22.1 ; also sheet 1
GND: C31.2(C2) C32.2(C2) C33.2(C2) C34.2(C2) C37.2(C2) C40.2(C2) C41.2(C2) C42.2(C2) C43.2(C2) C44.2(C2) C45.2(C2) C46.2(C2) C47.2(C2) C48.2(C2) C49.2(C2) C50.2(C2) C51.2(C2) C52.2(C2) C53.2(C2) C54.2(C2) C55.2(C2) C56.2(C2) D2.C D3.C R17.1 R18.1 R19.1 R26.1 R28.1 U4.2(.1:GND) U4.7(.2:GND) U4.29(.CNTRL:GND) U4.30(.CNTRL:GND) U4.31(.CNTRL:GND) U4.32(.CNTRL:GND) U4.33(.CNTRL:GND) U4.34(.CNTRL:GND) U4.35(.CNTRL:GND) U4.36(.CNTRL:GND) U4.37(.CNTRL:GND) U4.38(.CNTRL:GND) U5.10(VSS) ; also sheet 1,2,3,5
I2C1_SCL: U5.2(SCL) ; also sheet 1,3
I2C1_SDA: U5.3(SDA) ; also sheet 1,3
N$3: R19.2 U4.1(.CNTRL:RT)
N$8: R22.2 U4.10(.CNTRL:TEMP)
N$11: D2.A R29.1
N$23: D3.A R30.1
VBIAS1: C51.1(C1) C53.1(C1) C55.1(C1) F1.1 R29.2 ; also sheet 2,5
VBIAS1_BST: C35.2(C2) U4.15(.2:BST)
VBIAS1_EN: R17.2 U4.9(.2:EN/UV) ; also sheet 1
VBIAS1_FB: C38.2(C2) R23.1 R25.1 R26.2 U4.27(.2:FB)
VBIAS1_PG: R20.1 U4.12(.2:PG) ; also sheet 1
VBIAS1_SS: C32.1(C1) U4.26(.2:SS)
VBIAS1_SW: C35.1(C1) L17.1 U4.16(.2:SW) U4.17(.2:SW)
VBIAS1_UNFUSED: C38.1(C1) C41.1(C1) C43.1(C1) C45.1(C1) C47.1(C1) F1.2 L17.2 R25.2
VBIAS1_VADJ: R23.2 U5.6(VOUTA)
VBIAS2: C52.1(C1) C54.1(C1) C56.1(C1) F2.1 R30.2 ; also sheet 2,5
VBIAS2_BST: C36.2(C2) U4.20(.1:BST)
VBIAS2_EN: R18.2 U4.8(.1:EN/UV) ; also sheet 1
VBIAS2_FB: C39.2(C2) R24.1 R27.1 R28.2 U4.24(.1:FB)
VBIAS2_PG: R21.1 U4.11(.1:PG) ; also sheet 1
VBIAS2_SS: C33.1(C1) U4.25(.1:SS)
VBIAS2_SW: C36.1(C1) L18.1 U4.18(.1:SW) U4.19(.1:SW)
VBIAS2_UNFUSED: C39.1(C1) C42.1(C1) C44.1(C1) C46.1(C1) C49.1(C1) F2.2 L18.2 R27.2
VBIAS2_VADJ: R24.2 U5.7(VOUTB)
VBIAS_VCC: C31.1(C1) U4.13(.CNTRL:SYNC) U4.21(.CNTRL:VCC) U4.23(.1:VC) U4.28(.2:VC)
VIN: C37.1(C1) C40.1(C1) U4.3(.1:VIN) U4.4(.1:VIN) U4.5(.2:VIN) U4.6(.2:VIN) ; also sheet 5
Unconnected: U4.14(.CNTRL:CLKOUT) U5.5(!BSY) U5.8(VOUTC) U5.9(VOUTD)

### Notes on the sheet
- Vadj = -0.191 * Vout + 3.94887
  Vout = -5.2356 * Vadj + 20.67475
- FCM w/ Spread Spectrum
- f = 2 MHz
  DS. Table 1
- I2C Address 0x62
- Vadj = -0.191 * Vout + 3.94887
  Vout = -5.2356 * Vadj + 20.67475

## Sheet 5 of 5: Power 2 - Misc
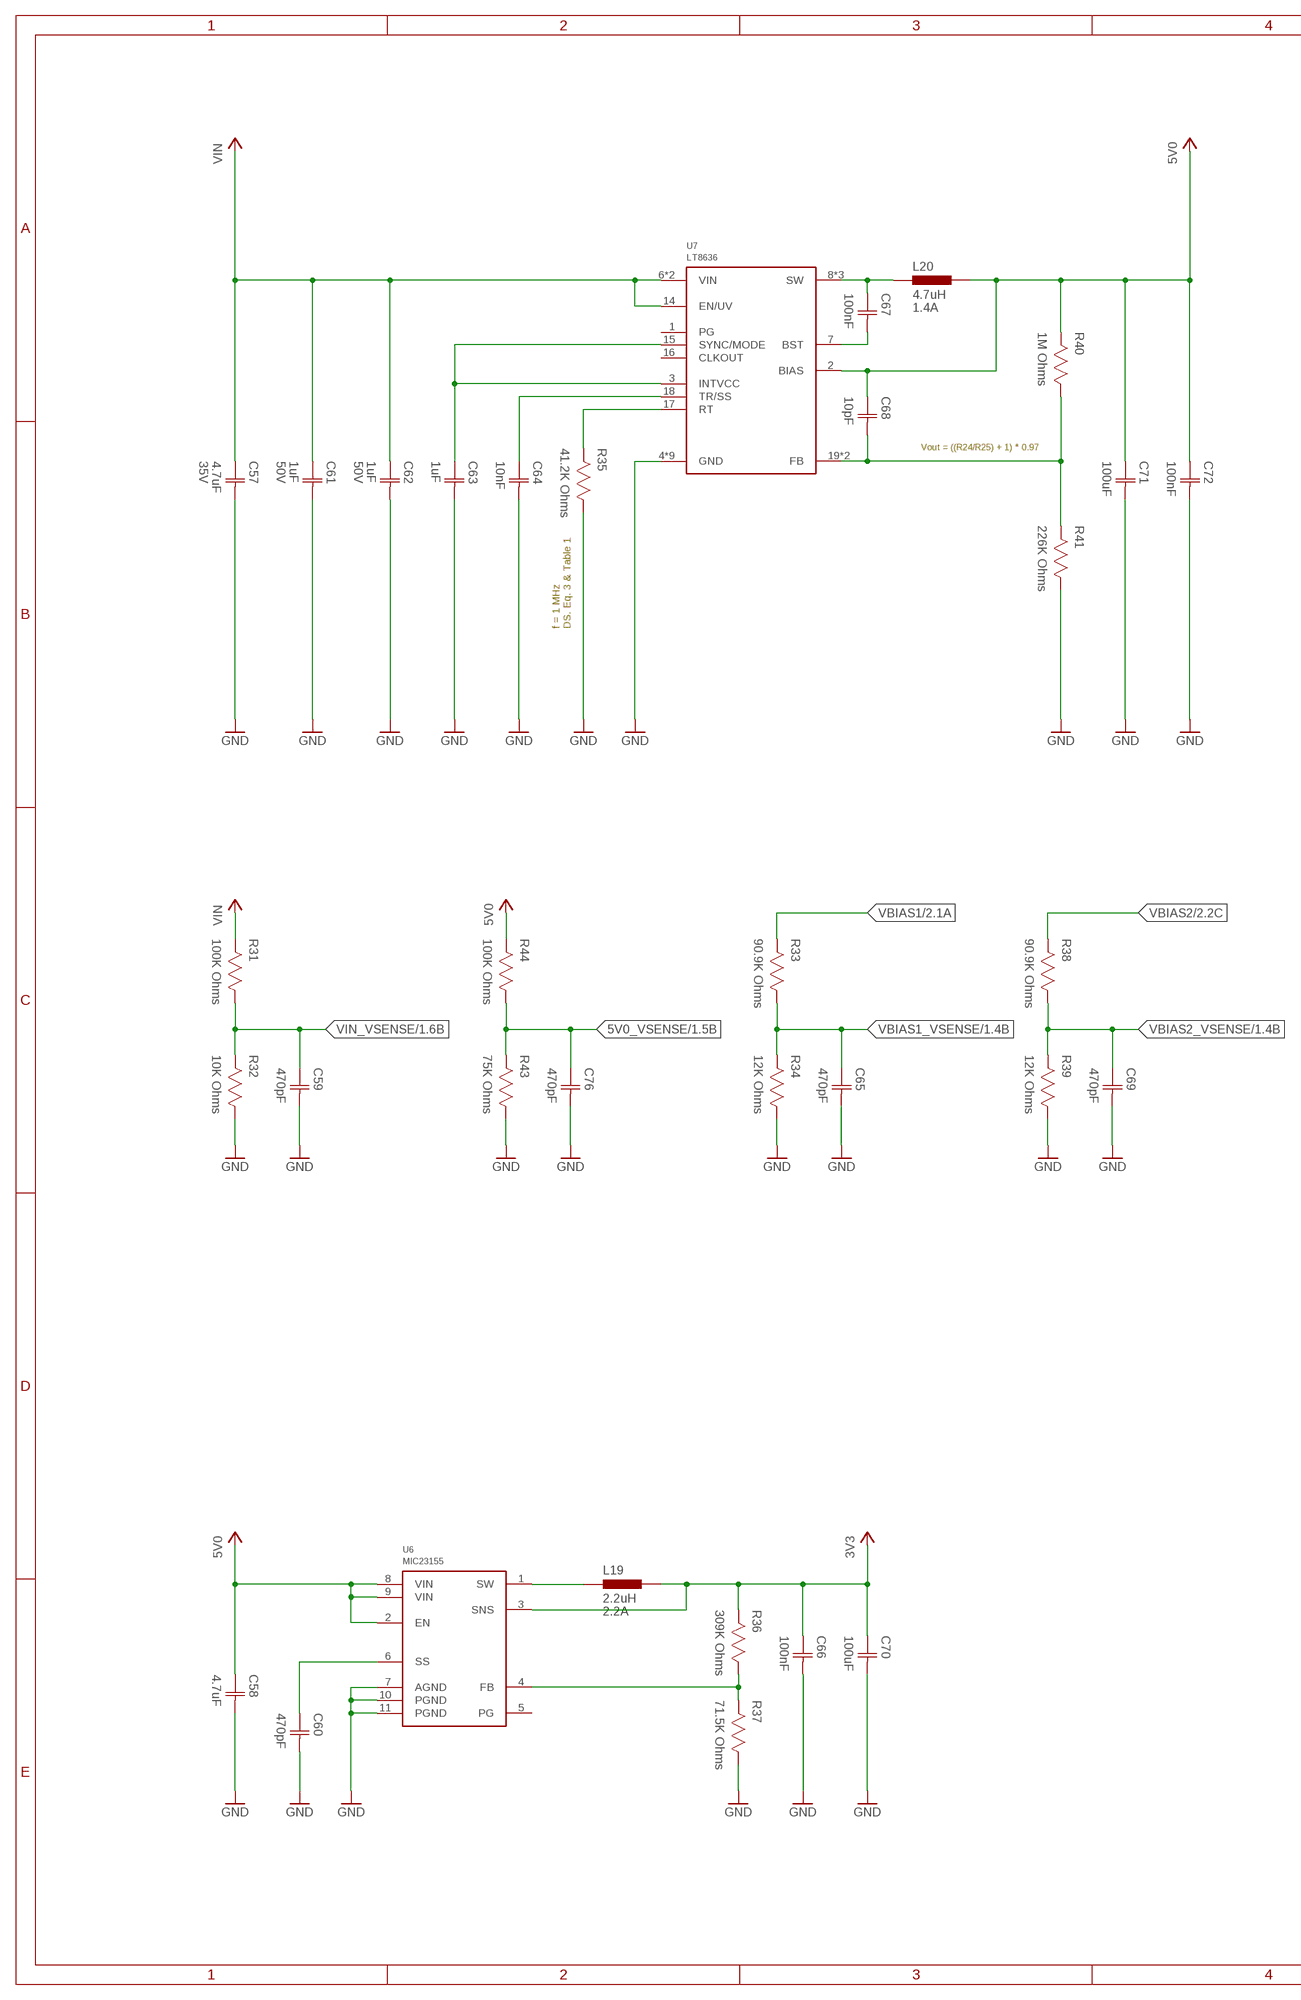
[diagram p8: schematic, sheet 5, part 1 of 2]
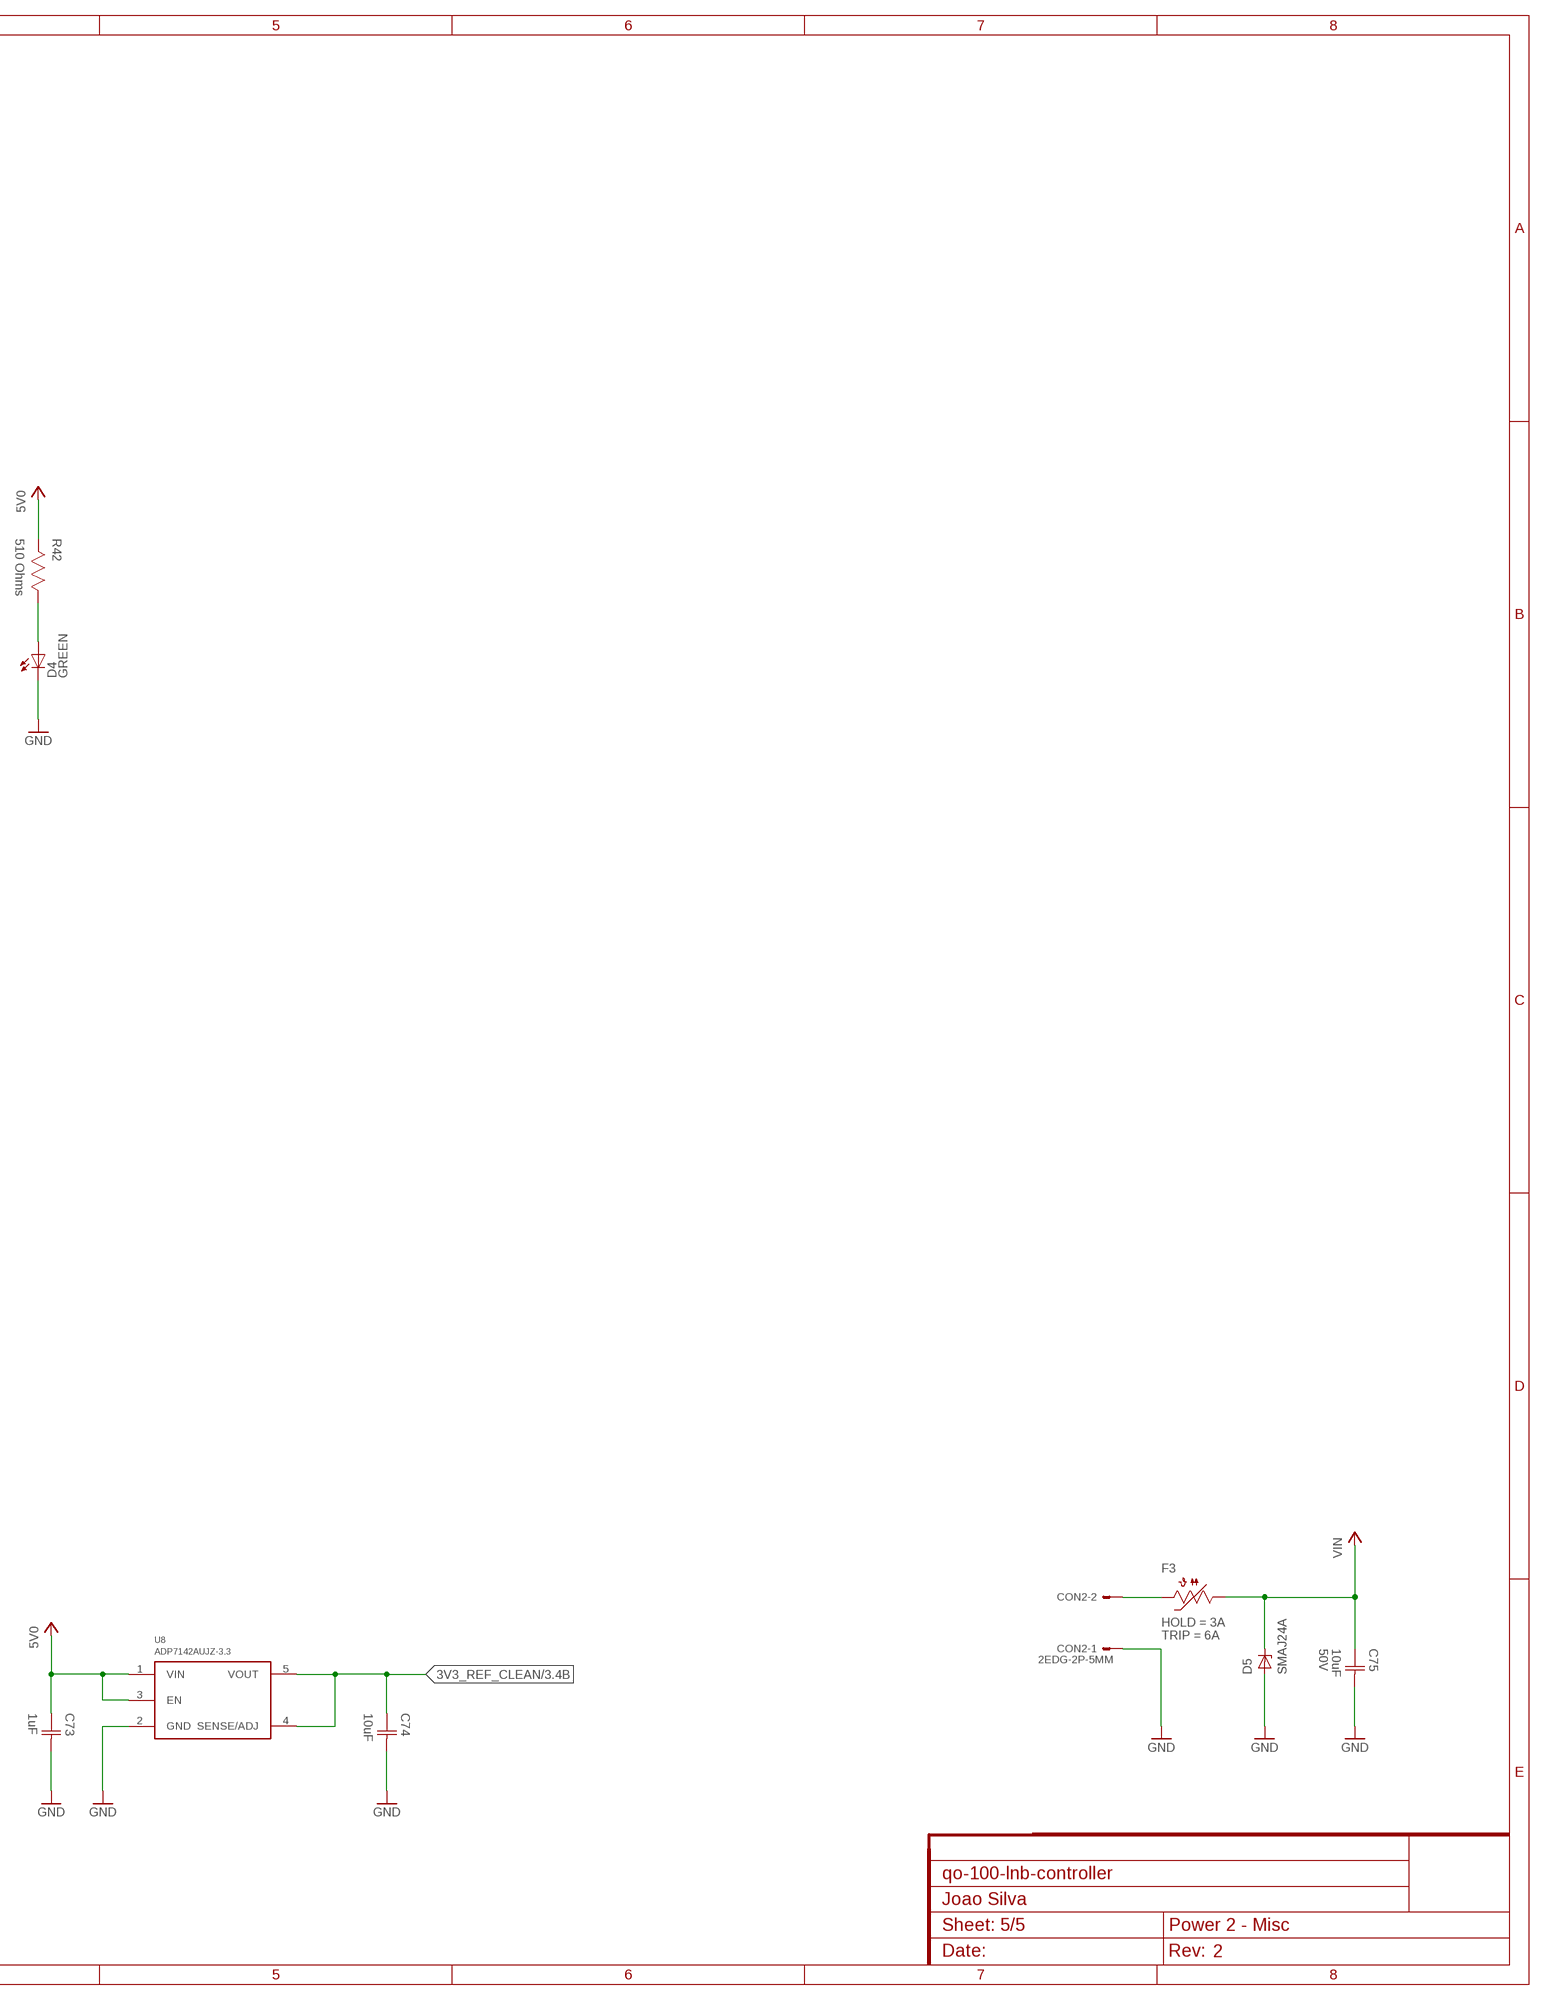
[diagram p9: schematic, sheet 5, part 2 of 2]

### Parts
C57  4.7uF  CAPACITOR-0603  [CAP0603]
C58  4.7uF  CAPACITOR-0603  [CAP0603]
C59  470pF  CAPACITOR-0603  [CAP0603]
C60  470pF  CAPACITOR-0603  [CAP0603]
C61  1uF  CAPACITOR-0603  [CAP0603]
C62  1uF  CAPACITOR-0603  [CAP0603]
C63  1uF  CAPACITOR-0603  [CAP0603]
C64  10nF  CAPACITOR-0603  [CAP0603]
C65  470pF  CAPACITOR-0603  [CAP0603]
C66  100nF  CAPACITOR-0603  [CAP0603]
C67  100nF  CAPACITOR-0603  [CAP0603]
C68  10pF  CAPACITOR-0603  [CAP0603]
C69  470pF  CAPACITOR-0603  [CAP0603]
C70  100uF  CAPACITOR-1206  [CAP1206]
C71  100uF  CAPACITOR-1206  [CAP1206]
C72  100nF  CAPACITOR-0603  [CAP0603]
C73  1uF  CAPACITOR-0603  [CAP0603]
C74  10uF  CAPACITOR-0603  [CAP0603]
C75  10uF  CAPACITOR-1206  [CAP1206]
C76  470pF  CAPACITOR-0603  [CAP0603]
CON2  2EDG-2P-5MM  [2EDG-2P-5MM]
D4  LED0603  [0603]
D5  SMAJ24A  [DO214AC]
F3  2.6A Hold  PTC1206  [1206]
L19  2.2uH  INDUCTOR-2.5X2X1.2MM  [IND2520]
L20  4.7uH  INDUCTOR-2.5X2X1.2MM  [IND2520]
R31  100K Ohms  RESISTOR-0603  [RES0603]
R32  10K Ohms  RESISTOR-0603  [RES0603]
R33  90.9K Ohms  RESISTOR-0603  [RES0603]
R34  12K Ohms  RESISTOR-0603  [RES0603]
R35  41.2K Ohms  RESISTOR-0603  [RES0603]
R36  309K Ohms  RESISTOR-0603  [RES0603]
R37  71.5K Ohms  RESISTOR-0603  [RES0603]
R38  90.9K Ohms  RESISTOR-0603  [RES0603]
R39  12K Ohms  RESISTOR-0603  [RES0603]
R40  1M Ohms  RESISTOR-0603  [RES0603]
R41  226K Ohms  RESISTOR-0603  [RES0603]
R42  510 Ohms  RESISTOR-0603  [RES0603]
R43  75K Ohms  RESISTOR-0603  [RES0603]
R44  100K Ohms  RESISTOR-0603  [RES0603]
U6  MIC23155  [DFN10]
U7  LT8636  [QFN20_ASYM_CORNER]
U8  ADP7142AUJZ-3.3  [SOT23-5]

### Nets
3V3: C66.1(C1) C70.1(C1) L19.2 R36.2 U6.3(SNS) ; also sheet 1,3,4
3V3_FB: R36.1 R37.2 U6.4(FB)
3V3_REF_CLEAN: C74.1(C1) U8.4(SENSE/ADJ) U8.5(VOUT) ; also sheet 3
3V3_SOFTSTART: C60.1(C1) U6.6(SS)
3V3_SW: L19.1 U6.1(SW)
5V0: C58.1(C1) C68.1(C1) C71.1(C1) C72.1(C1) C73.1(C1) L20.2 R40.2 R42.2 R44.2 U6.2(EN) U6.8(VIN) U6.9(VIN) U7.2(BIAS) U8.1(VIN) U8.3(EN) ; also sheet 4
5V0_BST: C67.2(C2) U7.7(BST)
5V0_FB: C68.2(C2) R40.1 R41.2 U7.19(FB) U7.20(FB)
5V0_INTVCC: C63.1(C1) U7.3(INTVCC) U7.15(SYNC/MODE)
5V0_RT: R35.2 U7.17(RT)
5V0_SS: C64.1(C1) U7.18(TR/SS)
5V0_SW: C67.1(C1) L20.1 U7.8(SW) U7.9(SW) U7.10(SW)
5V0_VSENSE: C76.1(C1) R43.2 R44.1 ; also sheet 1
GND: C57.2(C2) C58.2(C2) C59.2(C2) C60.2(C2) C61.2(C2) C62.2(C2) C63.2(C2) C64.2(C2) C65.2(C2) C66.2(C2) C69.2(C2) C70.2(C2) C71.2(C2) C72.2(C2) C73.2(C2) C74.2(C2) C75.2(C2) C76.2(C2) CON2.P$1 D4.C D5.A R32.1 R34.1 R35.1 R37.1 R39.1 R41.1 R43.1 U6.7(AGND) U6.10(PGND) U6.11(PGND) U7.4(GND) U7.5(GND) U7.12(GND) U7.13(GND) U7.21(GND) U7.M1(GND) U7.M2(GND) U7.M3(GND) U7.M4(GND) U8.2(GND) ; also sheet 1,2,3,4
N$19: CON2.P$2 F3.2
N$149: D4.A R42.1
VBIAS1: R33.2 ; also sheet 2,4
VBIAS1_VSENSE: C65.1(C1) R33.1 R34.2 ; also sheet 1
VBIAS2: R38.2 ; also sheet 2,4
VBIAS2_VSENSE: C69.1(C1) R38.1 R39.2 ; also sheet 1
VIN: C57.1(C1) C61.1(C1) C62.1(C1) C75.1(C1) D5.C F3.1 R31.2 U7.6(VIN) U7.11(VIN) U7.14(EN/UV) ; also sheet 4
VIN_VSENSE: C59.1(C1) R31.1 R32.2 ; also sheet 1
Unconnected: U6.5(PG) U7.1(PG) U7.16(CLKOUT)

### Notes on the sheet
- Vout = ((R24/R25) + 1) * 0.97
- f = 1 MHz
  DS. Eq. 3 & Table 1

## Library data of the parts
C1-C36 C38 C39 C45-C50 C55 C56 C58-C60 C63-C74 C76 = Capacitor:CAPACITOR
C37 C57 = Capacitor:CAPACITOR; VOLTAGE: 35V
C40 C61 C62 C75 = Capacitor:CAPACITOR; VOLTAGE: 50V
C41-C44 C51-C54 = Capacitor:CAPACITOR; VOLTAGE: 25V
CON1 = JST:3P: Disconnectable Crimp style connector, 1.0mm pitch 3 contacts
CON2 = Generic Connector:2EDG-2P
D1 = LED:LED; COLOR: BLUE
D2 D3 = LED:LED; COLOR: RED
D4 = LED:LED; COLOR: GREEN
D5 = TVS:SMAJ*A: SMAJ Series TVS Diodes Source: http://www.littelfuse.com/~/media/electronics/datasheets/tvs_diodes/littelfuse_tvs_diode_smaj_datasheet.pdf.pdf; MF: Littelfuse; MPN: SMAJ24A; OC_FARNELL: 1886345; OC_NEWARK: 06R1865
F1 F2 = PTC Fuses:PTC; HOLD: 750 mA; TRIP: 1.5 A
F3 = PTC Fuses:PTC; HOLD: 3A; OCLCSC: C207041; TRIP: 6A
L1-L4 = Inductor:INDUCTOR; CURRENT: 600 mA
L5-L16 = Inductor:INDUCTOR
L17 L18 = Inductor:INDUCTOR; CURRENT: 4A
L19 = Inductor:INDUCTOR; CURRENT: 2.2A; OCLCSC: C375952
L20 = Inductor:INDUCTOR; CURRENT: 1.4A; OCLCSC: C443497
LOGO1 = Silkscreen:JS
R1-R46 = Resistor:RESISTOR
RFCON1-RFCON6 = RF Connector:RFCON
TC1 = TagConnect:TC2050-IDC
U1 = EFM32:EFM32TG11B1*M32
U2 = Crystal:DSB321SDA
U3 = Silicon Labs:SI5351C-B-GM
U4 = Analog Devices:LT8650S-1
U5 = Microchip:MCP4728-A*
U6 = Microchip:MIC23155
U7 = Analog Devices:LT8636
U8 = Analog Devices:ADP7142AUJZ*

## Net classes
1 75 Ohm: width 0.5 mm, clearance 0.3 mm